# Altium project AVR Board 4.0.PrjPCB
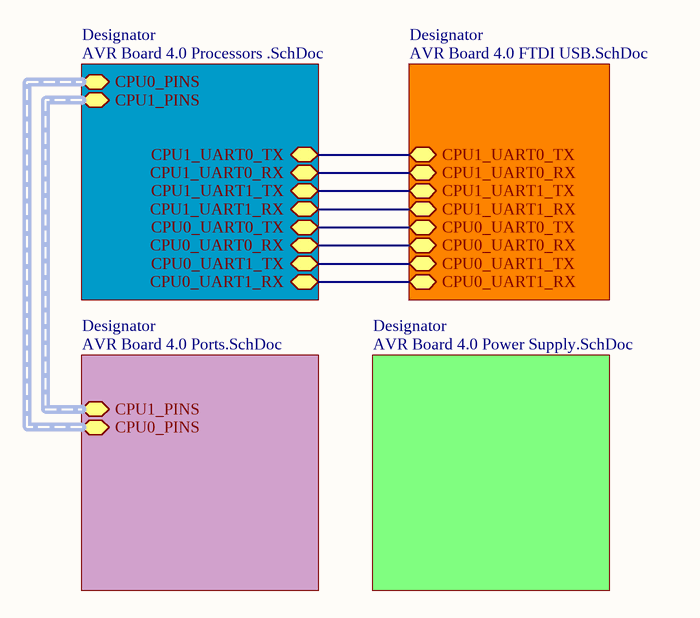
[diagram p0: AVR Board 4.0 Master Sheet.SchDoc]
5 sheets, 133 parts. Net scope: hierarchical (ports join the sheet entries above them; power ports are global).
Board files: AVR Board 4.0 R1.2 Alternate.PcbDoc, AVR Board 4.0 R1.PcbDoc
Sheets:
  AVR Board 4.0 Master Sheet.SchDoc
    Designator = AVR Board 4.0 Processors .SchDoc
    Designator = AVR Board 4.0 FTDI USB.SchDoc
    Designator = AVR Board 4.0 Ports.SchDoc
    Designator = AVR Board 4.0 Power Supply.SchDoc

## Sheet AVR Board 4.0 Master Sheet.SchDoc
size A

### Sub-sheets
Designator = AVR Board 4.0 Processors .SchDoc: CPU1_PINS (harness CPU1_PORTS), CPU0_PINS (harness CPU0_PORTS), CPU1_UART0_TX, CPU1_UART0_RX, CPU1_UART1_TX, CPU1_UART1_RX, CPU0_UART0_TX, CPU0_UART0_RX, CPU0_UART1_TX, CPU0_UART1_RX
Designator = AVR Board 4.0 FTDI USB.SchDoc: CPU1_UART0_TX, CPU1_UART0_RX, CPU1_UART1_TX, CPU1_UART1_RX, CPU0_UART0_TX, CPU0_UART0_RX, CPU0_UART1_TX, CPU0_UART1_RX
Designator = AVR Board 4.0 Ports.SchDoc: CPU1_PINS (harness CPU1_PORTS), CPU0_PINS (harness CPU0_PORTS)
Designator = AVR Board 4.0 Power Supply.SchDoc: no entries

### Nets
NetFTDI_Serial_1: sheet Designator/CPU1_UART0_RX, sheet Designator/CPU1_UART0_RX
NetFTDI_Serial_3: sheet Designator/CPU1_UART0_TX, sheet Designator/CPU1_UART0_TX
NetFTDI_Serial_5: sheet Designator/CPU1_UART1_RX, sheet Designator/CPU1_UART1_RX
NetFTDI_Serial_7: sheet Designator/CPU1_UART1_TX, sheet Designator/CPU1_UART1_TX
NetFTDI_Serial_9: sheet Designator/CPU0_UART0_RX, sheet Designator/CPU0_UART0_RX
NetFTDI_Serial_11: sheet Designator/CPU0_UART0_TX, sheet Designator/CPU0_UART0_TX
NetFTDI_Serial_13: sheet Designator/CPU0_UART1_RX, sheet Designator/CPU0_UART1_RX
NetFTDI_Serial_15: sheet Designator/CPU0_UART1_TX, sheet Designator/CPU0_UART1_TX

## Sheet AVR Board 4.0 Processors .SchDoc
size B
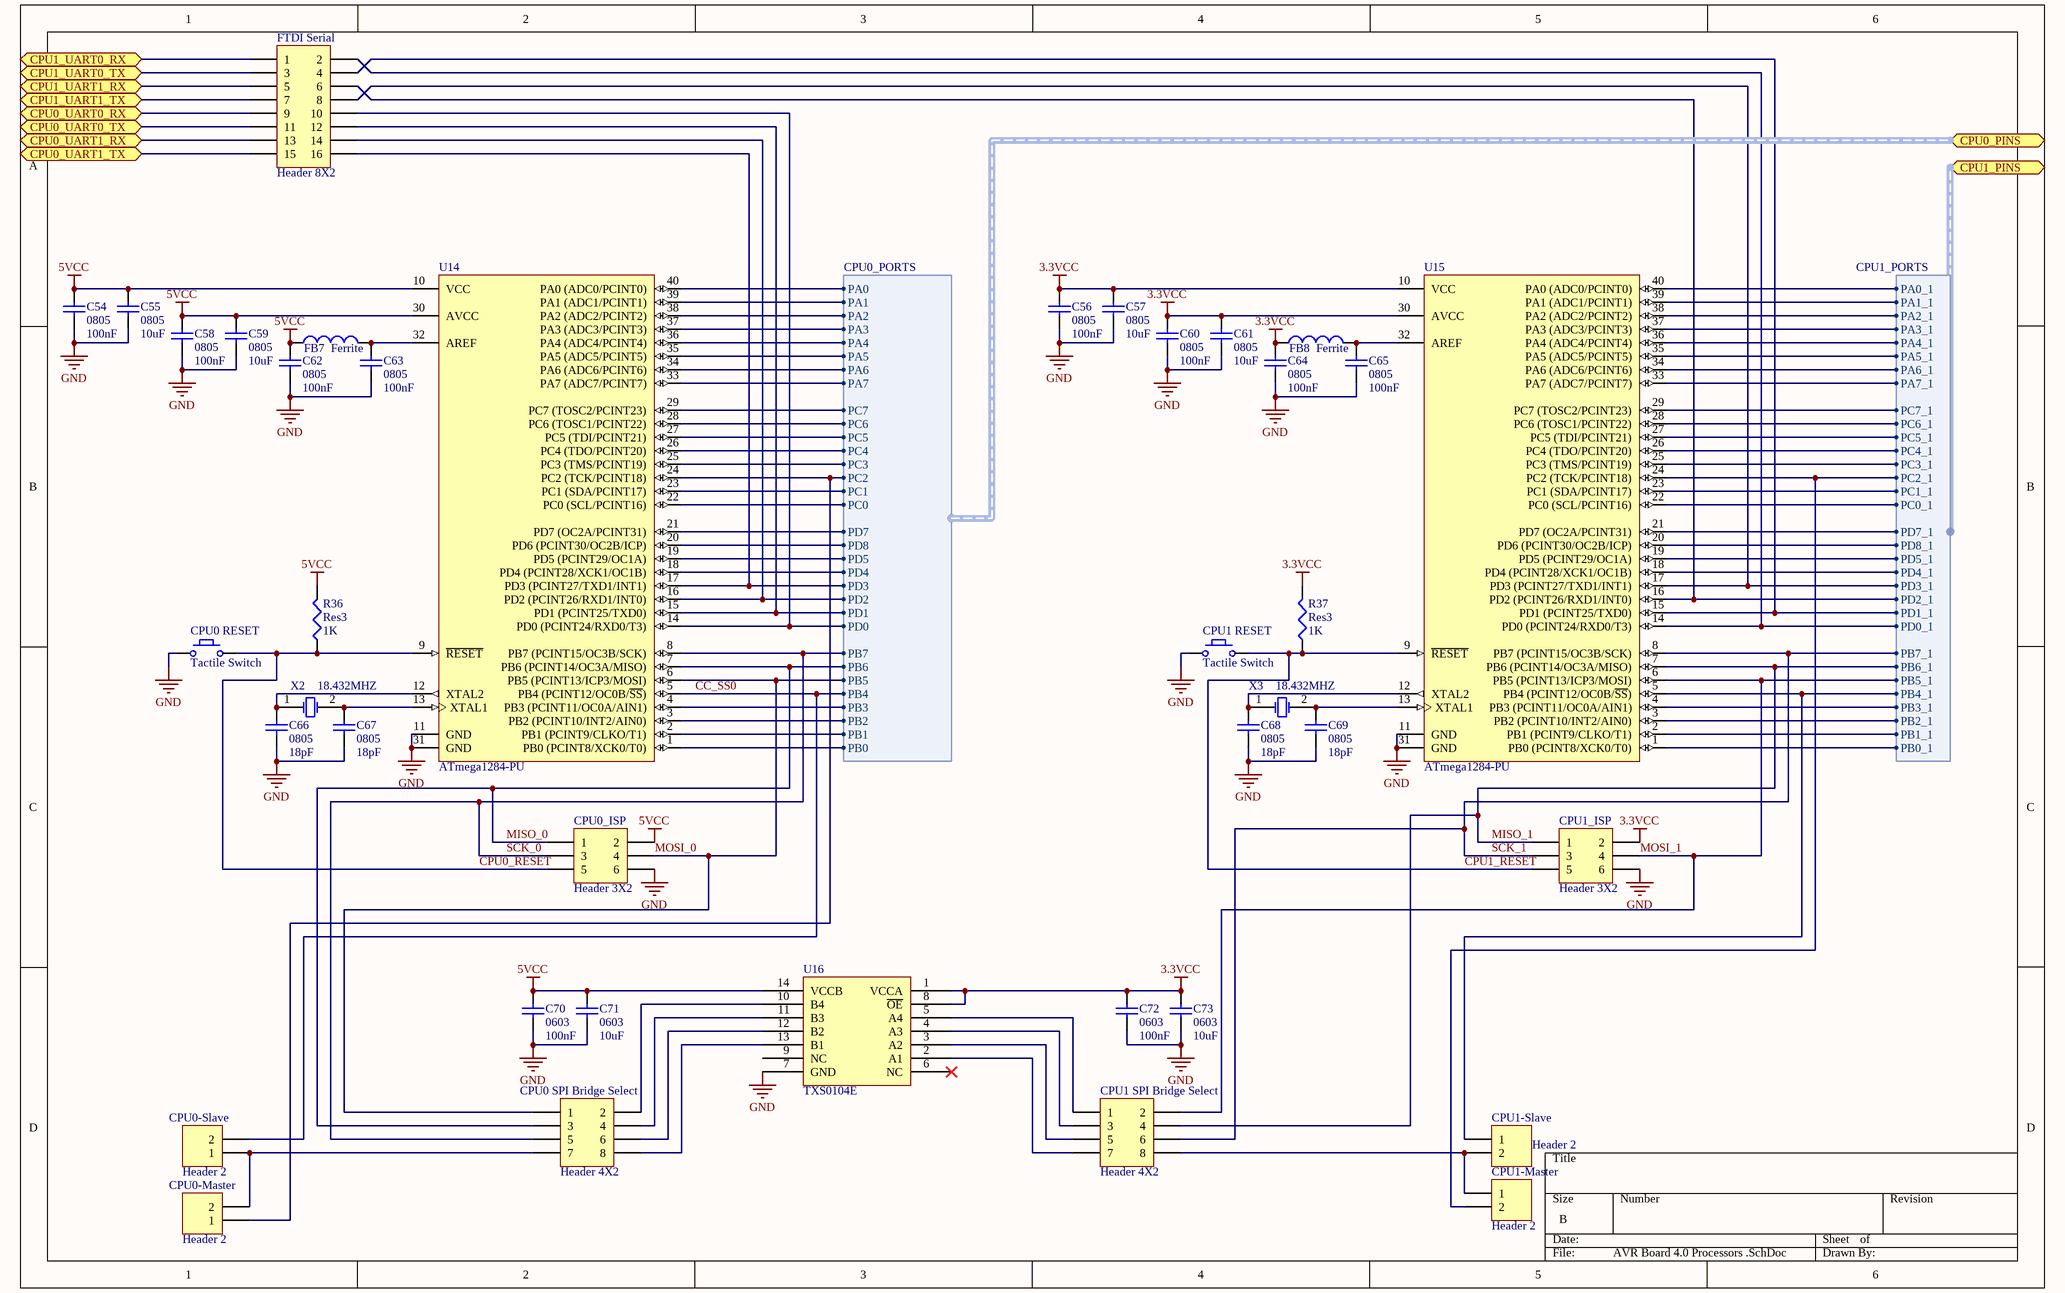
[diagram p1: AVR Board 4.0 Processors .SchDoc]

### Parts
C54  0805  value 100nF  [SM 0805 - gap trimmed]
C55  0805  value 10uF  [SM 0805 - gap trimmed]
C56  0805  value 100nF  [SM 0805 - gap trimmed]
C57  0805  value 10uF  [SM 0805 - gap trimmed]
C58  0805  value 100nF  [SM 0805 - gap trimmed]
C59  0805  value 10uF  [SM 0805 - gap trimmed]
C60  0805  value 100nF  [SM 0805 - gap trimmed]
C61  0805  value 10uF  [SM 0805 - gap trimmed]
C62  0805  value 100nF  [SM 0805 - gap trimmed]
C63  0805  value 100nF  [SM 0805 - gap trimmed]
C64  0805  value 100nF  [SM 0805 - gap trimmed]
C65  0805  value 100nF  [SM 0805 - gap trimmed]
C66  0805  value 18pF  [SM 0805 - gap trimmed]
C67  0805  value 18pF  [SM 0805 - gap trimmed]
C68  0805  value 18pF  [SM 0805 - gap trimmed]
C69  0805  value 18pF  [SM 0805 - gap trimmed]
C70  0603  value 100nF  [1608[0603]]
C71  0603  value 10uF  [1608[0603]]
C72  0603  value 100nF  [1608[0603]]
C73  0603  value 10uF  [1608[0603]]
CPU0-Master  Header 2  [HDR1X2]
CPU0-Slave  Header 2  [HDR1X2]
CPU0_ISP  Header 3X2  [HDR2X3]
CPU0_RESET  Tactile Switch  [Mountain Switch TS6324T1607]
CPU0_SPI_Bridge_Select  Header 4X2  [HDR2X4]
CPU1-Master  Header 2  [HDR1X2]
CPU1-Slave  Header 2  [HDR1X2]
CPU1_ISP  Header 3X2  [HDR2X3]
CPU1_RESET  Tactile Switch  [Mountain Switch TS6324T1607]
CPU1_SPI_Bridge_Select  Header 4X2  [HDR2X4]
FB7  value Ferrite  [SM 0805 - gap trimmed]  (hidden comment: Inductor)
FB8  value Ferrite  [SM 0805 - gap trimmed]  (hidden comment: Inductor)
FTDI_Serial  Header 8X2  [HDR2X8]
R36  Res3  value 1K  [J1-0603]
R37  Res3  value 1K  [J1-0603]
U14  ATmega1284-PU  [40P6]
U15  ATmega1284-PU  [40P6]
U16  TXS0104E  [SOIC127P600X175-14N]
X2  18.432MHZ  [radial 4.88]
X3  18.432MHZ  [radial 4.88]

### Ports
CPU0_PINS (harness CPU0_PORTS), CPU0_UART0_RX, CPU0_UART0_TX, CPU0_UART1_RX, CPU0_UART1_TX, CPU1_PINS (harness CPU1_PORTS), CPU1_UART0_RX, CPU1_UART0_TX, CPU1_UART1_RX, CPU1_UART1_TX

### Harnesses
CPU0_PORTS: PA0, PA1, PA2, PA3, PA4, PA5, PA6, PA7, PC0, PC1, PC2, PC3, PC4, PC5, PC6, PC7, PD7, PD8, PD5, PD4, PD3, PD2, PD1, PD0, PB7, PB6, PB5, PB4, PB3, PB2, PB1, PB0
CPU1_PORTS: PA0_1, PA1_1, PA2_1, PA3_1, PA4_1, PA5_1, PA6_1, PA7_1, PC0_1, PC1_1, PC2_1, PC3_1, PC4_1, PC5_1, PC6_1, PC7_1, PD7_1, PD8_1, PD5_1, PD4_1, PD3_1, PD2_1, PD1_1, PD0_1, PB7_1, PB6_1, PB5_1, PB4_1, PB3_1, PB2_1, PB1_1, PB0_1

### Nets
3.3VCC: C56.2 C57.2 C60.2 C61.2 C64.2 C72.2 C73.2 CPU1_ISP.2 FB8.1 R37.2 U15.10(VCC) U15.30(AVCC) U16.1(VCCA) U16.8(~{OE})
5VCC: C54.2 C55.2 C58.2 C59.2 C62.2 C70.2 C71.2 CPU0_ISP.2 FB7.1 R36.2 U14.10(VCC) U14.30(AVCC) U16.14(VCCB)
GND: C54.1 C55.1 C56.1 C57.1 C58.1 C59.1 C60.1 C61.1 C62.1 C63.1 C64.1 C65.1 C66.1 C67.1 C68.1 C69.1 C70.1 C71.1 C72.1 C73.1 CPU0_ISP.6 CPU0_RESET.1 CPU1_ISP.6 CPU1_RESET.1 U14.11(GND) U14.31(GND) U15.11(GND) U15.31(GND) U16.7(GND)
CC_SS0: CPU0-Slave.2 U14.5(PB4_(PCINT12/OC0B/~{SS})) ; port CPU0_PINS.PB4
CPU0_RESET: CPU0_ISP.5 CPU0_RESET.2 R36.1 U14.9(~{RESET})
CPU1_RESET: CPU1_ISP.5 CPU1_RESET.2 R37.1 U15.9(~{RESET})
MISO_0: CPU0_ISP.1 CPU0_SPI_Bridge_Select.3 U14.7(PB6_(PCINT14/OC3A/MISO)) ; port CPU0_PINS.PB6
MISO_1: CPU1_ISP.1 CPU1_SPI_Bridge_Select.4 U15.7(PB6_(PCINT14/OC3A/MISO)) ; port CPU1_PINS.PB6_1
MOSI_0: CPU0_ISP.4 CPU0_SPI_Bridge_Select.1 U14.6(PB5_(PCINT13/ICP3/MOSI)) ; port CPU0_PINS.PB5
MOSI_1: CPU1_ISP.4 CPU1_SPI_Bridge_Select.2 U15.6(PB5_(PCINT13/ICP3/MOSI)) ; port CPU1_PINS.PB5_1
SCK_0: CPU0_ISP.3 CPU0_SPI_Bridge_Select.5 U14.8(PB7_(PCINT15/OC3B/SCK)) ; port CPU0_PINS.PB7
SCK_1: CPU1_ISP.3 CPU1_SPI_Bridge_Select.6 U15.8(PB7_(PCINT15/OC3B/SCK)) ; port CPU1_PINS.PB7_1
NetC63_2: C63.2 FB7.2 U14.32(AREF)
NetC65_2: C65.2 FB8.2 U15.32(AREF)
NetC66_2: C66.2 U14.12(XTAL2) X2.1(OSC1)
NetC67_2: C67.2 U14.13(XTAL1) X2.2(OSC2)
NetC68_2: C68.2 U15.12(XTAL2) X3.1(OSC1)
NetC69_2: C69.2 U15.13(XTAL1) X3.2(OSC2)
NetCPU0-Master_1: CPU0-Master.1 U14.24(PC2_(TCK/PCINT18)) ; port CPU0_PINS.PC2
NetCPU0-Master_2: CPU0-Master.2 CPU0-Slave.1 CPU0_SPI_Bridge_Select.7
NetCPU0_GPIO_/_ADC_/_SPI_/_TWI_/_UART_1: U14.1(PB0_(PCINT8/XCK0/T0)) ; port CPU0_PINS.PB0
NetCPU0_GPIO_/_ADC_/_SPI_/_TWI_/_UART_2: U14.40(PA0_(ADC0/PCINT0)) ; port CPU0_PINS.PA0
NetCPU0_GPIO_/_ADC_/_SPI_/_TWI_/_UART_3: U14.2(PB1_(PCINT9/CLKO/T1)) ; port CPU0_PINS.PB1
NetCPU0_GPIO_/_ADC_/_SPI_/_TWI_/_UART_4: U14.39(PA1_(ADC1/PCINT1)) ; port CPU0_PINS.PA1
NetCPU0_GPIO_/_ADC_/_SPI_/_TWI_/_UART_5: U14.3(PB2_(PCINT10/INT2/AIN0)) ; port CPU0_PINS.PB2
NetCPU0_GPIO_/_ADC_/_SPI_/_TWI_/_UART_6: U14.38(PA2_(ADC2/PCINT2)) ; port CPU0_PINS.PA2
NetCPU0_GPIO_/_ADC_/_SPI_/_TWI_/_UART_7: U14.4(PB3_(PCINT11/OC0A/AIN1)) ; port CPU0_PINS.PB3
NetCPU0_GPIO_/_ADC_/_SPI_/_TWI_/_UART_8: U14.37(PA3_(ADC3/PCINT3)) ; port CPU0_PINS.PA3
NetCPU0_GPIO_/_ADC_/_SPI_/_TWI_/_UART_10: U14.36(PA4_(ADC4/PCINT4)) ; port CPU0_PINS.PA4
NetCPU0_GPIO_/_ADC_/_SPI_/_TWI_/_UART_12: U14.35(PA5_(ADC5/PCINT5)) ; port CPU0_PINS.PA5
NetCPU0_GPIO_/_ADC_/_SPI_/_TWI_/_UART_14: U14.34(PA6_(ADC6/PCINT6)) ; port CPU0_PINS.PA6
NetCPU0_GPIO_/_ADC_/_SPI_/_TWI_/_UART_16: U14.33(PA7_(ADC7/PCINT7)) ; port CPU0_PINS.PA7
NetCPU0_GPIO_/_ADC_/_SPI_/_TWI_/_UART_17: FTDI_Serial.10 U14.14(PD0_(PCINT24/RXD0/T3)) ; port CPU0_PINS.PD0
NetCPU0_GPIO_/_ADC_/_SPI_/_TWI_/_UART_18: U14.29(PC7_(TOSC2/PCINT23)) ; port CPU0_PINS.PC7
NetCPU0_GPIO_/_ADC_/_SPI_/_TWI_/_UART_19: FTDI_Serial.12 U14.15(PD1_(PCINT25/TXD0)) ; port CPU0_PINS.PD1
NetCPU0_GPIO_/_ADC_/_SPI_/_TWI_/_UART_20: U14.28(PC6_(TOSC1/PCINT22)) ; port CPU0_PINS.PC6
NetCPU0_GPIO_/_ADC_/_SPI_/_TWI_/_UART_21: FTDI_Serial.14 U14.16(PD2_(PCINT26/RXD1/INT0)) ; port CPU0_PINS.PD2
NetCPU0_GPIO_/_ADC_/_SPI_/_TWI_/_UART_22: U14.27(PC5_(TDI/PCINT21)) ; port CPU0_PINS.PC5
NetCPU0_GPIO_/_ADC_/_SPI_/_TWI_/_UART_23: FTDI_Serial.16 U14.17(PD3_(PCINT27/TXD1/INT1)) ; port CPU0_PINS.PD3
NetCPU0_GPIO_/_ADC_/_SPI_/_TWI_/_UART_24: U14.26(PC4_(TDO/PCINT20)) ; port CPU0_PINS.PC4
NetCPU0_GPIO_/_ADC_/_SPI_/_TWI_/_UART_25: U14.18(PD4_(PCINT28/XCK1/OC1B)) ; port CPU0_PINS.PD4
NetCPU0_GPIO_/_ADC_/_SPI_/_TWI_/_UART_26: U14.25(PC3_(TMS/PCINT19)) ; port CPU0_PINS.PC3
NetCPU0_GPIO_/_ADC_/_SPI_/_TWI_/_UART_27: U14.19(PD5_(PCINT29/OC1A)) ; port CPU0_PINS.PD5
NetCPU0_GPIO_/_ADC_/_SPI_/_TWI_/_UART_29: U14.20(PD6_(PCINT30/OC2B/ICP)) ; port CPU0_PINS.PD8
NetCPU0_GPIO_/_ADC_/_SPI_/_TWI_/_UART_30: U14.23(PC1_(SDA/PCINT17)) ; port CPU0_PINS.PC1
NetCPU0_GPIO_/_ADC_/_SPI_/_TWI_/_UART_31: U14.21(PD7_(OC2A/PCINT31)) ; port CPU0_PINS.PD7
NetCPU0_GPIO_/_ADC_/_SPI_/_TWI_/_UART_32: U14.22(PC0_(SCL/PCINT16)) ; port CPU0_PINS.PC0
NetCPU0_SPI_Bridge_Select_2: CPU0_SPI_Bridge_Select.2 U16.10(B4)
NetCPU0_SPI_Bridge_Select_4: CPU0_SPI_Bridge_Select.4 U16.11(B3)
NetCPU0_SPI_Bridge_Select_6: CPU0_SPI_Bridge_Select.6 U16.12(B2)
NetCPU0_SPI_Bridge_Select_8: CPU0_SPI_Bridge_Select.8 U16.13(B1)
NetCPU1-Master_1: CPU1-Master.1 CPU1-Slave.2 CPU1_SPI_Bridge_Select.8
NetCPU1-Master_2: CPU1-Master.2 U15.24(PC2_(TCK/PCINT18)) ; port CPU1_PINS.PC2_1
NetCPU1-Slave_1: CPU1-Slave.1 U15.5(PB4_(PCINT12/OC0B/~{SS})) ; port CPU1_PINS.PB4_1
NetCPU1_GPIO_/_ADC_/_SPI_/_TWI_/_UART_1: U15.1(PB0_(PCINT8/XCK0/T0)) ; port CPU1_PINS.PB0_1
NetCPU1_GPIO_/_ADC_/_SPI_/_TWI_/_UART_2: U15.40(PA0_(ADC0/PCINT0)) ; port CPU1_PINS.PA0_1
NetCPU1_GPIO_/_ADC_/_SPI_/_TWI_/_UART_3: U15.2(PB1_(PCINT9/CLKO/T1)) ; port CPU1_PINS.PB1_1
NetCPU1_GPIO_/_ADC_/_SPI_/_TWI_/_UART_4: U15.39(PA1_(ADC1/PCINT1)) ; port CPU1_PINS.PA1_1
NetCPU1_GPIO_/_ADC_/_SPI_/_TWI_/_UART_5: U15.3(PB2_(PCINT10/INT2/AIN0)) ; port CPU1_PINS.PB2_1
NetCPU1_GPIO_/_ADC_/_SPI_/_TWI_/_UART_6: U15.38(PA2_(ADC2/PCINT2)) ; port CPU1_PINS.PA2_1
NetCPU1_GPIO_/_ADC_/_SPI_/_TWI_/_UART_7: U15.4(PB3_(PCINT11/OC0A/AIN1)) ; port CPU1_PINS.PB3_1
NetCPU1_GPIO_/_ADC_/_SPI_/_TWI_/_UART_8: U15.37(PA3_(ADC3/PCINT3)) ; port CPU1_PINS.PA3_1
NetCPU1_GPIO_/_ADC_/_SPI_/_TWI_/_UART_10: U15.36(PA4_(ADC4/PCINT4)) ; port CPU1_PINS.PA4_1
NetCPU1_GPIO_/_ADC_/_SPI_/_TWI_/_UART_12: U15.35(PA5_(ADC5/PCINT5)) ; port CPU1_PINS.PA5_1
NetCPU1_GPIO_/_ADC_/_SPI_/_TWI_/_UART_14: U15.34(PA6_(ADC6/PCINT6)) ; port CPU1_PINS.PA6_1
NetCPU1_GPIO_/_ADC_/_SPI_/_TWI_/_UART_16: U15.33(PA7_(ADC7/PCINT7)) ; port CPU1_PINS.PA7_1
NetCPU1_GPIO_/_ADC_/_SPI_/_TWI_/_UART_17: FTDI_Serial.2 U15.14(PD0_(PCINT24/RXD0/T3)) ; port CPU1_PINS.PD0_1
NetCPU1_GPIO_/_ADC_/_SPI_/_TWI_/_UART_18: U15.29(PC7_(TOSC2/PCINT23)) ; port CPU1_PINS.PC7_1
NetCPU1_GPIO_/_ADC_/_SPI_/_TWI_/_UART_19: FTDI_Serial.4 U15.15(PD1_(PCINT25/TXD0)) ; port CPU1_PINS.PD1_1
NetCPU1_GPIO_/_ADC_/_SPI_/_TWI_/_UART_20: U15.28(PC6_(TOSC1/PCINT22)) ; port CPU1_PINS.PC6_1
NetCPU1_GPIO_/_ADC_/_SPI_/_TWI_/_UART_21: FTDI_Serial.6 U15.16(PD2_(PCINT26/RXD1/INT0)) ; port CPU1_PINS.PD2_1
NetCPU1_GPIO_/_ADC_/_SPI_/_TWI_/_UART_22: U15.27(PC5_(TDI/PCINT21)) ; port CPU1_PINS.PC5_1
NetCPU1_GPIO_/_ADC_/_SPI_/_TWI_/_UART_23: FTDI_Serial.8 U15.17(PD3_(PCINT27/TXD1/INT1)) ; port CPU1_PINS.PD3_1
NetCPU1_GPIO_/_ADC_/_SPI_/_TWI_/_UART_24: U15.26(PC4_(TDO/PCINT20)) ; port CPU1_PINS.PC4_1
NetCPU1_GPIO_/_ADC_/_SPI_/_TWI_/_UART_25: U15.18(PD4_(PCINT28/XCK1/OC1B)) ; port CPU1_PINS.PD4_1
NetCPU1_GPIO_/_ADC_/_SPI_/_TWI_/_UART_26: U15.25(PC3_(TMS/PCINT19)) ; port CPU1_PINS.PC3_1
NetCPU1_GPIO_/_ADC_/_SPI_/_TWI_/_UART_27: U15.19(PD5_(PCINT29/OC1A)) ; port CPU1_PINS.PD5_1
NetCPU1_GPIO_/_ADC_/_SPI_/_TWI_/_UART_29: U15.20(PD6_(PCINT30/OC2B/ICP)) ; port CPU1_PINS.PD8_1
NetCPU1_GPIO_/_ADC_/_SPI_/_TWI_/_UART_30: U15.23(PC1_(SDA/PCINT17)) ; port CPU1_PINS.PC1_1
NetCPU1_GPIO_/_ADC_/_SPI_/_TWI_/_UART_31: U15.21(PD7_(OC2A/PCINT31)) ; port CPU1_PINS.PD7_1
NetCPU1_GPIO_/_ADC_/_SPI_/_TWI_/_UART_32: U15.22(PC0_(SCL/PCINT16)) ; port CPU1_PINS.PC0_1
NetCPU1_SPI_Bridge_Select_1: CPU1_SPI_Bridge_Select.1 U16.5(A4)
NetCPU1_SPI_Bridge_Select_3: CPU1_SPI_Bridge_Select.3 U16.4(A3)
NetCPU1_SPI_Bridge_Select_5: CPU1_SPI_Bridge_Select.5 U16.3(A2)
NetCPU1_SPI_Bridge_Select_7: CPU1_SPI_Bridge_Select.7 U16.2(A1)
NetFTDI_Serial_1: FTDI_Serial.1 ; port CPU1_UART0_RX
NetFTDI_Serial_3: FTDI_Serial.3 ; port CPU1_UART0_TX
NetFTDI_Serial_5: FTDI_Serial.5 ; port CPU1_UART1_RX
NetFTDI_Serial_7: FTDI_Serial.7 ; port CPU1_UART1_TX
NetFTDI_Serial_9: FTDI_Serial.9 ; port CPU0_UART0_RX
NetFTDI_Serial_11: FTDI_Serial.11 ; port CPU0_UART0_TX
NetFTDI_Serial_13: FTDI_Serial.13 ; port CPU0_UART1_RX
NetFTDI_Serial_15: FTDI_Serial.15 ; port CPU0_UART1_TX

Not connected (* = marked no-connect by the designer): U16 6(NC)* 9(NC)

### Library data of the parts
C54-C73 = Cap Semi: Capacitor (Semiconductor SIM Model); Published: 8-Jun-2000; LatestRevisionDate: 29-May-2009; LatestRevisionNote: IPC-7351 Footprint Added.; PackageReference: C1206; Publisher: Altium Limited; PackageDescription: Chip Capacitor
CPU0-Master CPU0-Slave CPU1-Master CPU1-Slave = Header 2: Header, 2-Pin; LatestRevisionDate: 17-Jul-2002; LatestRevisionNote: Re-released for DXP Platform.; Publisher: Altium Limited
CPU0_ISP CPU1_ISP = Header 3X2: Header, 3-Pin, Dual row; LatestRevisionDate: 17-Jul-2002; LatestRevisionNote: Re-released for DXP Platform.; Publisher: Altium Limited
CPU0_SPI_Bridge_Select CPU1_SPI_Bridge_Select = Header 4X2: Header, 4-Pin, Dual row; LatestRevisionDate: 17-Jul-2002; LatestRevisionNote: Re-released for DXP Platform.; Publisher: Altium Limited
FB7 FB8 = Inductor: Code_IEC: 1005; Published: 8-Jun-2000; LatestRevisionDate: 29-May-2009; LatestRevisionNote: IPC-7351 Footprint Added.; PackageReference: 0402-A; Publisher: Altium Limited; PackageDescription: Chip Inductor; Code_JEITA: 0402
FTDI_Serial = Header 8X2: Header, 8-Pin, Dual row; LatestRevisionDate: 17-Jul-2002; LatestRevisionNote: Re-released for DXP Platform.; Publisher: Altium Limited
R36 R37 = Res3: Resistor; Published: 8-Jun-2000; LatestRevisionDate: 29-May-2009; LatestRevisionNote: IPC-7351 Footprint Added.; PackageReference: J1-0603; Publisher: Altium Limited; PackageDescription: Chip Resistor
U14 U15 = ATmega1284-PU: 8-bit AVR Microcontroller, 128KB Flash, 4KB EEPROM, 16KB SRAM, 40-pin PDIP, Industrial Grade (-40°C to 85°C); DatasheetVersion: revC, Jun-2011; PackageVersion: revB, Sep-2001; PackageReference: 40P6; PackageDescription: 40-lead (0.600"/15.24mm Wide) Plastic Dual Inline Package (PDIP); Code_JEDEC: MS-011-AC; ComponentLink1Description: Manufacturer URL; ComponentLink1URL: http://www.atmel.com/; ComponentLink2Description: ATmega164A/164PA/324A/324PA/644A/644PA/1284/1284P Datasheet; ComponentLink2URL: http://www.atmel.com/dyn/resources/prod_documents/doc8272.pdf; ComponentLink3Description: ATmega164A/164PA/324A/324PA/644A/644PA/1284/1284P Summary; ComponentLink3URL: http://www.atmel.com/dyn/resources/prod_documents/8272S.pdf
X2 X3 = XTAL: Crystal Oscillator; Published: 8-Jun-2000; LatestRevisionDate: 17-Jul-2002; LatestRevisionNote: Re-released for DXP Platform.; PackageReference: R38; Publisher: Altium Limited; PackageDescription: Crystal, Thru-Hole; 2 Leads; Body 3.1 x 8.2 mm (Dia.xH)

## Sheet AVR Board 4.0 FTDI USB.SchDoc
size B
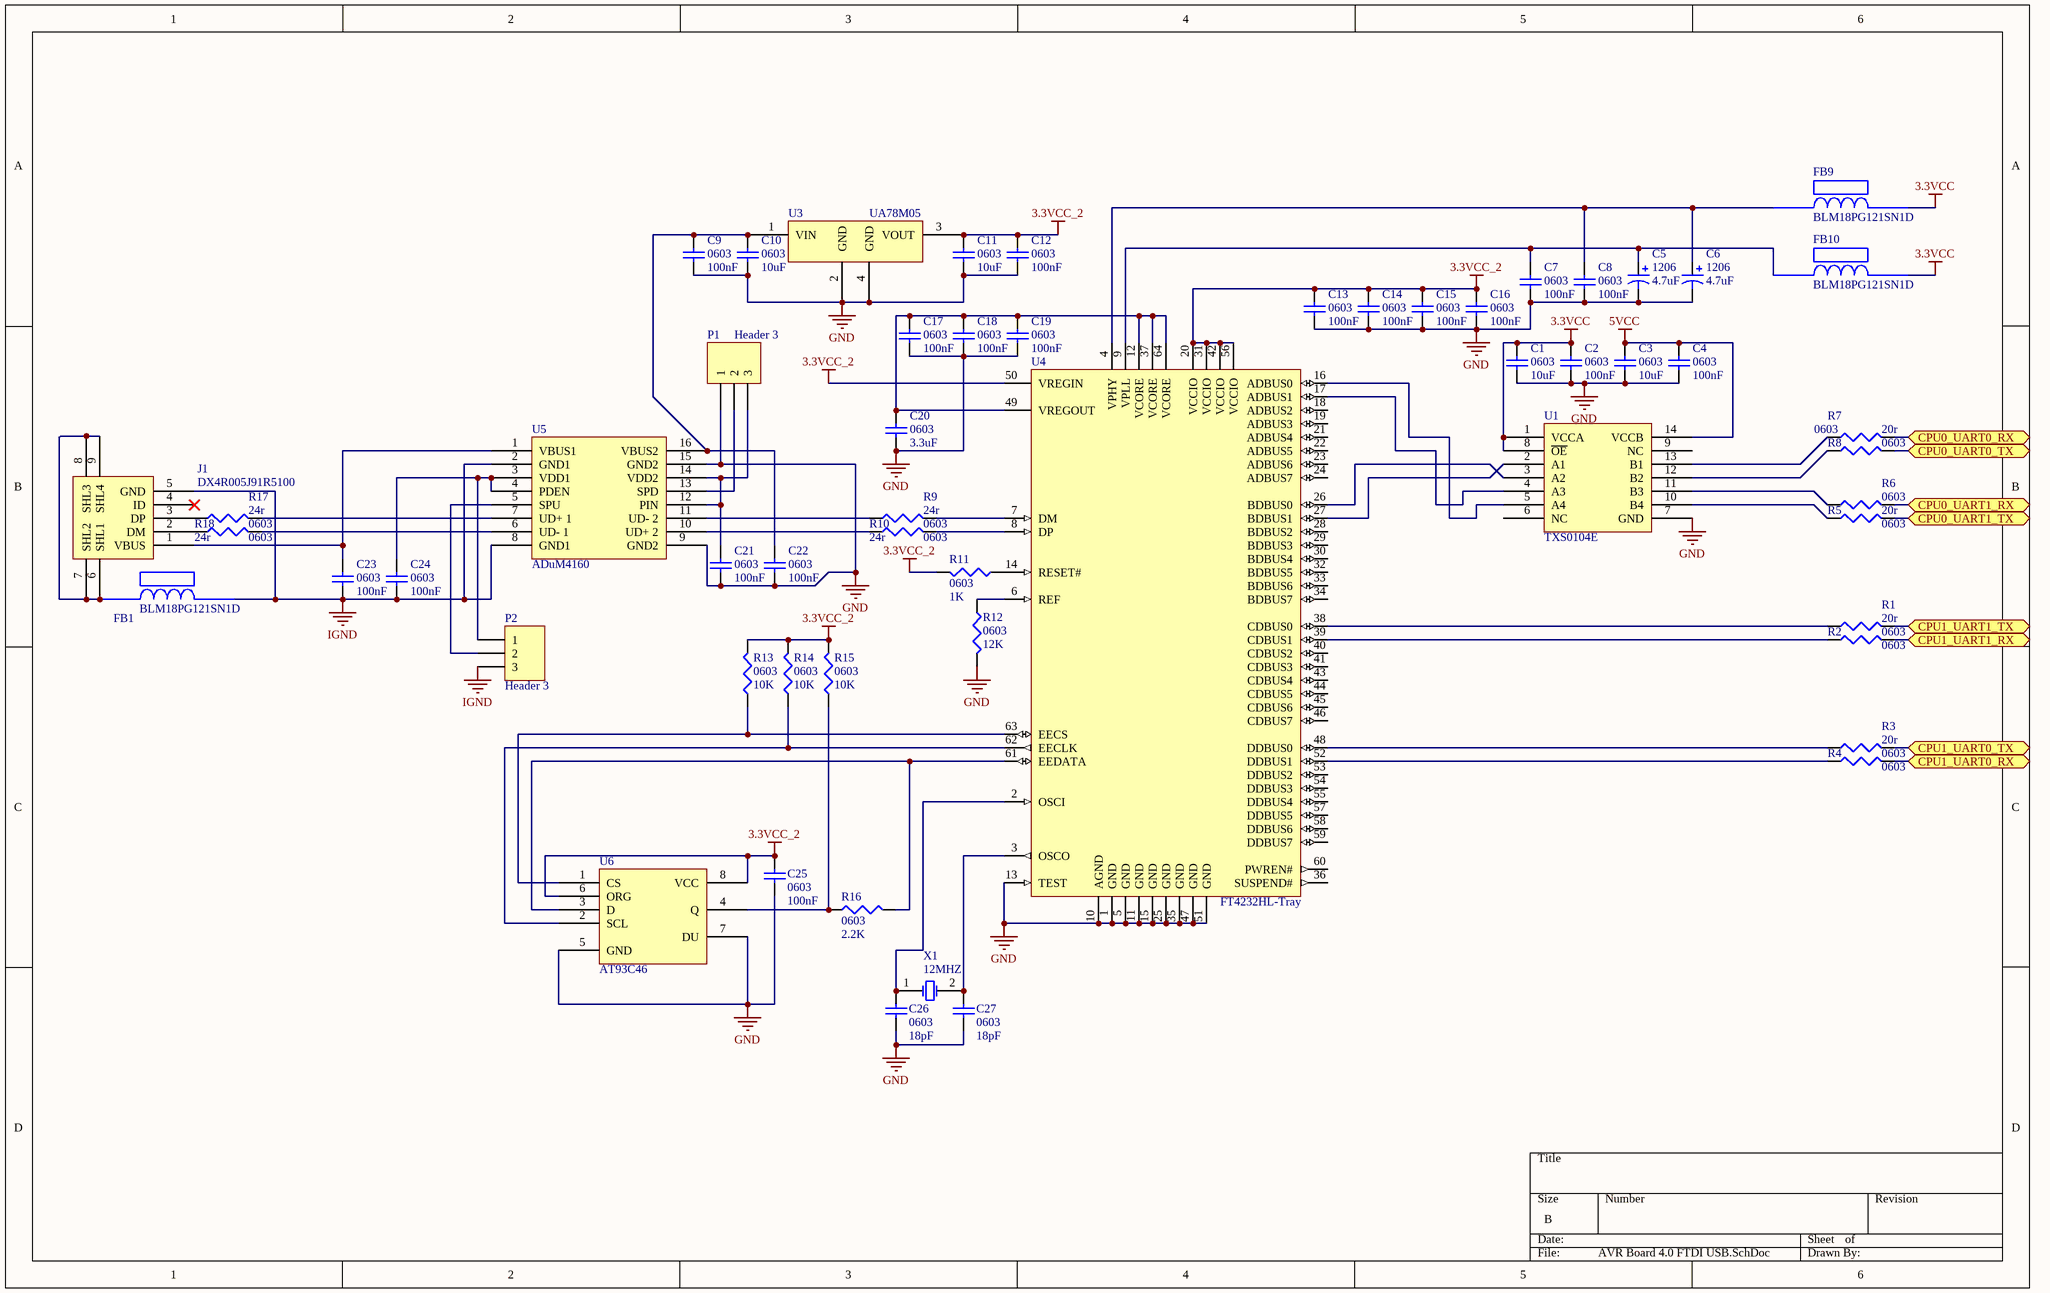
[diagram p2: AVR Board 4.0 FTDI USB.SchDoc]

### Parts
C1  0603  value 10uF  [1608[0603]]
C2  0603  value 100nF  [1608[0603]]
C3  0603  value 10uF  [1608[0603]]
C4  0603  value 100nF  [1608[0603]]
C5  1206  value 4.7uF  [C1206POL]
C6  1206  value 4.7uF  [C1206POL]
C7  0603  value 100nF  [1608[0603]]
C8  0603  value 100nF  [1608[0603]]
C9  0603  value 100nF  [1608[0603]]
C10  0603  value 10uF  [1608[0603]]
C11  0603  value 10uF  [1608[0603]]
C12  0603  value 100nF  [1608[0603]]
C13  0603  value 100nF  [1608[0603]]
C14  0603  value 100nF  [1608[0603]]
C15  0603  value 100nF  [1608[0603]]
C16  0603  value 100nF  [1608[0603]]
C17  0603  value 100nF  [1608[0603]]
C18  0603  value 100nF  [1608[0603]]
C19  0603  value 100nF  [1608[0603]]
C20  0603  value 3.3uF  [1608[0603]]
C21  0603  value 100nF  [1608[0603]]
C22  0603  value 100nF  [1608[0603]]
C23  0603  value 100nF  [1608[0603]]
C24  0603  value 100nF  [1608[0603]]
C25  0603  value 100nF  [1608[0603]]
C26  0603  value 18pF  [1608[0603]]
C27  0603  value 18pF  [1608[0603]]
FB1  BLM18PG121SN1D  [BLM18PG121SN1D]
FB9  BLM18PG121SN1D  [BLM18PG121SN1D]
FB10  BLM18PG121SN1D  [BLM18PG121SN1D]
J1  DX4R005J91R5100  [Micro USB Circular Holes Only]
P1  Header 3  [HDR1X3]
P2  Header 3  [HDR1X3]
R1  0603  value 20r  [J1-0603]
R2  0603  [J1-0603]
R3  0603  value 20r  [J1-0603]
R4  0603  [J1-0603]
R5  0603  value 20r  [J1-0603]
R6  0603  [J1-0603]
R7  0603  value 20r  [J1-0603]
R8  0603  [J1-0603]
R9  0603  value 24r  [J1-0603]
R10  0603  value 24r  [J1-0603]
R11  0603  value 1K  [J1-0603]
R12  0603  value 12K  [J1-0603]
R13  0603  value 10K  [J1-0603]
R14  0603  value 10K  [J1-0603]
R15  0603  value 10K  [J1-0603]
R16  0603  value 2.2K  [J1-0603]
R17  0603  value 24r  [J1-0603]
R18  0603  value 24r  [J1-0603]
U1  TXS0104E  [SOIC127P600X175-14N]
U3  UA78M05  [SOT230P700X180-4N]
U4  FT4232HL-Tray  [LQFP-64_N]
U5  ADuM4160  [ADuM4160]
U6  AT93C46  [SOIC127P600X175-8N]
X1  12MHZ  [445C35A12M00000]

### Ports
CPU0_UART0_RX, CPU0_UART0_TX, CPU0_UART1_RX, CPU0_UART1_TX, CPU1_UART0_RX, CPU1_UART0_TX, CPU1_UART1_RX, CPU1_UART1_TX

### Nets
3.3VCC: C1.2 C2.2 FB9.2 FB10.2 U1.1(VCCA) U1.8(~{OE})
3.3VCC_2: C11.2 C12.2 C13.2 C14.2 C15.2 C16.2 C25.2 R11.2 R13.2 R14.2 R15.2 U3.3(VOUT) U4.20(VCCIO) U4.31(VCCIO) U4.42(VCCIO) U4.50(VREGIN) U4.56(VCCIO) U6.6(ORG) U6.8(VCC)
5VCC: C3.2 C4.2 U1.14(VCCB)
GND: C1.1 C2.1 C3.1 C4.1 C5.2 C6.2 C7.1 C8.1 C9.1 C10.1 C11.1 C12.1 C13.1 C14.1 C15.1 C16.1 C17.1 C18.1 C19.1 C20.1 C21.1 C22.1 C25.1 C26.1 C27.1 P1.1 R12.2 U1.7(GND) U3.2(GND) U3.4(GND) U4.1(GND) U4.5(GND) U4.10(AGND) U4.11(GND) U4.13(TEST) U4.15(GND) U4.25(GND) U4.35(GND) U4.47(GND) U4.51(GND) U5.9(GND2) U5.15(GND2) U6.5(GND) U6.7(DU)
IGND: C23.1 C24.1 FB1.2 J1.5(GND) P2.3 U5.2(GND1) U5.8(GND1)
NetC5_1: C5.1 C7.2 FB10.1 U4.9(VPLL)
NetC6_1: C6.1 C8.2 FB9.1 U4.4(VPHY)
NetC9_2: C9.2 C10.2 C22.2 U3.1(VIN) U5.16(VBUS2)
NetC17_2: C17.2 C18.2 C19.2 C20.2 U4.12(VCORE) U4.37(VCORE) U4.49(VREGOUT) U4.64(VCORE)
NetC21_2: C21.2 P1.3 U5.12(PIN) U5.14(VDD2)
NetC23_2: C23.2 J1.1(VBUS) U5.1(VBUS1)
NetC24_2: C24.2 P2.1 U5.3(VDD1) U5.4(PDEN)
NetC26_2: C26.2 U4.2(OSCI) X1.1(OSC1)
NetC27_2: C27.2 U4.3(OSCO) X1.2(OSC2)
NetFB1_1: FB1.1 J1.6(SHL1) J1.7(SHL2) J1.8(SHL3) J1.9(SHL4)
NetFTDI_Serial_1: R4.2 ; port CPU1_UART0_RX
NetFTDI_Serial_3: R3.2 ; port CPU1_UART0_TX
NetFTDI_Serial_5: R2.2 ; port CPU1_UART1_RX
NetFTDI_Serial_7: R1.2 ; port CPU1_UART1_TX
NetFTDI_Serial_9: R7.2 ; port CPU0_UART0_RX
NetFTDI_Serial_11: R8.2 ; port CPU0_UART0_TX
NetFTDI_Serial_13: R6.2 ; port CPU0_UART1_RX
NetFTDI_Serial_15: R5.2 ; port CPU0_UART1_TX
NetJ1_2: J1.2(DM) R18.1
NetJ1_3: J1.3(DP) R17.1
NetP1_2: P1.2 U5.13(SPD)
NetP2_2: P2.2 U5.5(SPU)
NetR1_1: R1.1 U4.38(CDBUS0)
NetR2_1: R2.1 U4.39(CDBUS1)
NetR3_1: R3.1 U4.48(DDBUS0)
NetR4_1: R4.1 U4.52(DDBUS1)
NetR5_1: R5.1 U1.10(B4)
NetR6_1: R6.1 U1.11(B3)
NetR7_1: R7.1 U1.13(B1)
NetR8_1: R8.1 U1.12(B2)
NetR9_1: R9.1 U5.11(UD-_2)
NetR9_2: R9.2 U4.7(DM)
NetR10_1: R10.1 U5.10(UD+_2)
NetR10_2: R10.2 U4.8(DP)
NetR11_1: R11.1 U4.14(RESET#)
NetR12_1: R12.1 U4.6(REF)
NetR13_1: R13.1 U4.63(EECS) U6.1(CS)
NetR14_1: R14.1 U4.62(EECLK) U6.2(SCL)
NetR15_1: R15.1 R16.1 U6.4(Q)
NetR16_2: R16.2 U4.61(EEDATA) U6.3(D)
NetR17_2: R17.2 U5.7(UD+_1)
NetR18_2: R18.2 U5.6(UD-_1)
NetU1_2: U1.2(A1) U4.27(BDBUS1)
NetU1_3: U1.3(A2) U4.26(BDBUS0)
NetU1_4: U1.4(A3) U4.17(ADBUS1)
NetU1_5: U1.5(A4) U4.16(ADBUS0)

Not connected (* = marked no-connect by the designer): J1 4(ID)*; U1 6(NC) 9(NC); U4 18(ADBUS2) 19(ADBUS3) 21(ADBUS4) 22(ADBUS5) 23(ADBUS6) 24(ADBUS7) 28(BDBUS2) 29(BDBUS3) 30(BDBUS4) 32(BDBUS5) 33(BDBUS6) 34(BDBUS7) 36(SUSPEND#) 40(CDBUS2) 41(CDBUS3) 43(CDBUS4) 44(CDBUS5) 45(CDBUS6) 46(CDBUS7) 53(DDBUS2) 54(DDBUS3) 55(DDBUS4) 57(DDBUS5) 58(DDBUS6) 59(DDBUS7) 60(PWREN#)

### Library data of the parts
C1-C4 C7-C27 = Cap Semi: Capacitor (Semiconductor SIM Model); Published: 8-Jun-2000; LatestRevisionDate: 29-May-2009; LatestRevisionNote: IPC-7351 Footprint Added.; PackageReference: C1206; Publisher: Altium Limited; PackageDescription: Chip Capacitor
C5 C6 = Cap Pol3: Polarized Capacitor (Surface Mount); Published: 8-Jun-2000; LatestRevisionDate: 29-May-2009; LatestRevisionNote: IPC-7351 Footprint Added.; PackageReference: C0805; Publisher: Altium Limited; PackageDescription: Chip Capacitor
J1 = Micro USB: Micro USB Jack B
P1 P2 = Header 3: Header, 3-Pin; LatestRevisionDate: 17-Jul-2002; LatestRevisionNote: Re-released for DXP Platform.; Publisher: Altium Limited
R1-R18 = Res3: Resistor; Published: 8-Jun-2000; LatestRevisionDate: 29-May-2009; LatestRevisionNote: IPC-7351 Footprint Added.; PackageReference: J1-0603; Publisher: Altium Limited; PackageDescription: Chip Resistor
U4 = FT4232HL-Tray: Quad High Speed USB To Multipurpose UART/MPSSE IC, 64-pin LQFP, Tray; Manufacturer: FTDI; DatasheetVersion: ver 2.2, Jan-2012; PackageVersion: Jan-12; PackageReference: LQFP-64; PackageDescription: 64-Pin Thin Quad Flat Pack, 10 x 10 x 1.4 mm Body, 0.5 mm Pitch; PartNumber: FT4232HL-Tray; ComponentLink1Description: Manufacturer URL; ComponentLink1URL: http://www.ftdichip.com/; ComponentLink2Description: Datasheet; ComponentLink2URL: http://www.ftdichip.com/Support/Documents/DataSheets/ICs/DS_FT4232H.pdf
U5 = ADuM4160: USB Opto Isolator
X1 = XTAL: Crystal Oscillator; Published: 8-Jun-2000; LatestRevisionDate: 17-Jul-2002; LatestRevisionNote: Re-released for DXP Platform.; PackageReference: R38; Publisher: Altium Limited; PackageDescription: Crystal, Thru-Hole; 2 Leads; Body 3.1 x 8.2 mm (Dia.xH)

## Sheet AVR Board 4.0 Ports.SchDoc
size A
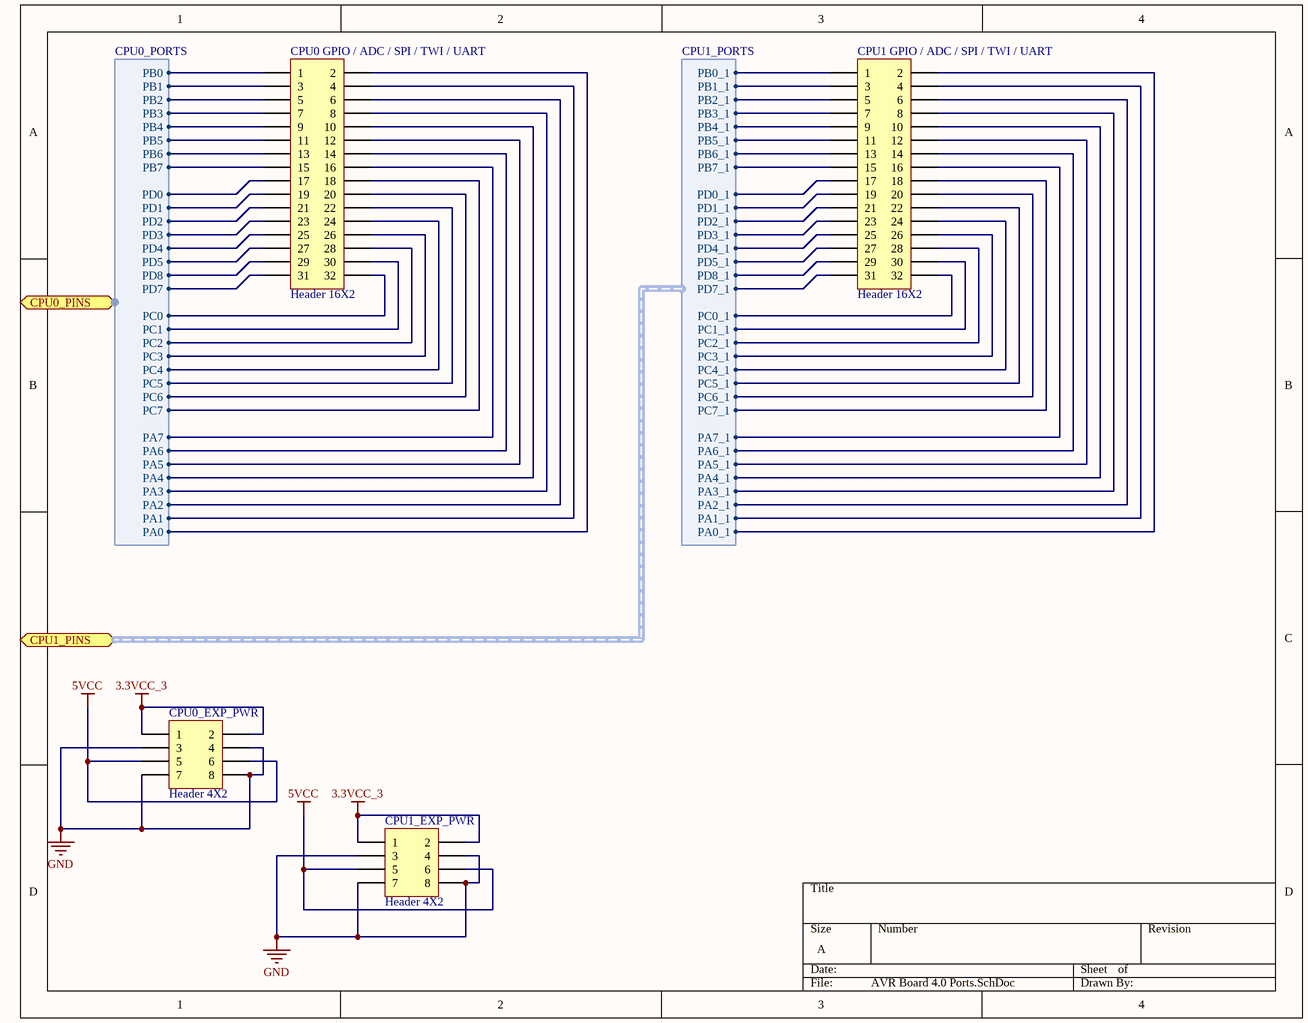
[diagram p3: AVR Board 4.0 Ports.SchDoc]

### Parts
CPU0_EXP_PWR  Header 4X2  [HDR2X4]
CPU0_GPIO_/_ADC_/_SPI_/_TWI_/_UART  Header 16X2  [HDR2X16]
CPU1_EXP_PWR  Header 4X2  [HDR2X4]
CPU1_GPIO_/_ADC_/_SPI_/_TWI_/_UART  Header 16X2  [HDR2X16]

### Ports
CPU0_PINS (harness CPU0_PORTS), CPU1_PINS (harness CPU1_PORTS)

### Harnesses
CPU0_PORTS: PA0, PA1, PA2, PA3, PA4, PA5, PA6, PA7, PC0, PC1, PC2, PC3, PC4, PC5, PC6, PC7, PD7, PD8, PD5, PD4, PD3, PD2, PD1, PD0, PB7, PB6, PB5, PB4, PB3, PB2, PB1, PB0
CPU1_PORTS: PA0_1, PA1_1, PA2_1, PA3_1, PA4_1, PA5_1, PA6_1, PA7_1, PC0_1, PC1_1, PC2_1, PC3_1, PC4_1, PC5_1, PC6_1, PC7_1, PD7_1, PD8_1, PD5_1, PD4_1, PD3_1, PD2_1, PD1_1, PD0_1, PB7_1, PB6_1, PB5_1, PB4_1, PB3_1, PB2_1, PB1_1, PB0_1

### Nets
3.3VCC_3: CPU0_EXP_PWR.1 CPU0_EXP_PWR.2 CPU1_EXP_PWR.1 CPU1_EXP_PWR.2
5VCC: CPU0_EXP_PWR.5 CPU0_EXP_PWR.6 CPU1_EXP_PWR.5 CPU1_EXP_PWR.6
GND: CPU0_EXP_PWR.3 CPU0_EXP_PWR.4 CPU0_EXP_PWR.7 CPU0_EXP_PWR.8 CPU1_EXP_PWR.3 CPU1_EXP_PWR.4 CPU1_EXP_PWR.7 CPU1_EXP_PWR.8
CC_SS0: CPU0_GPIO_/_ADC_/_SPI_/_TWI_/_UART.9 ; port CPU0_PINS.PB4
MISO_0: CPU0_GPIO_/_ADC_/_SPI_/_TWI_/_UART.13 ; port CPU0_PINS.PB6
MISO_1: CPU1_GPIO_/_ADC_/_SPI_/_TWI_/_UART.13 ; port CPU1_PINS.PB6_1
MOSI_0: CPU0_GPIO_/_ADC_/_SPI_/_TWI_/_UART.11 ; port CPU0_PINS.PB5
MOSI_1: CPU1_GPIO_/_ADC_/_SPI_/_TWI_/_UART.11 ; port CPU1_PINS.PB5_1
SCK_0: CPU0_GPIO_/_ADC_/_SPI_/_TWI_/_UART.15 ; port CPU0_PINS.PB7
SCK_1: CPU1_GPIO_/_ADC_/_SPI_/_TWI_/_UART.15 ; port CPU1_PINS.PB7_1
NetCPU0-Master_1: CPU0_GPIO_/_ADC_/_SPI_/_TWI_/_UART.28 ; port CPU0_PINS.PC2
NetCPU0_GPIO_/_ADC_/_SPI_/_TWI_/_UART_1: CPU0_GPIO_/_ADC_/_SPI_/_TWI_/_UART.1 ; port CPU0_PINS.PB0
NetCPU0_GPIO_/_ADC_/_SPI_/_TWI_/_UART_2: CPU0_GPIO_/_ADC_/_SPI_/_TWI_/_UART.2 ; port CPU0_PINS.PA0
NetCPU0_GPIO_/_ADC_/_SPI_/_TWI_/_UART_3: CPU0_GPIO_/_ADC_/_SPI_/_TWI_/_UART.3 ; port CPU0_PINS.PB1
NetCPU0_GPIO_/_ADC_/_SPI_/_TWI_/_UART_4: CPU0_GPIO_/_ADC_/_SPI_/_TWI_/_UART.4 ; port CPU0_PINS.PA1
NetCPU0_GPIO_/_ADC_/_SPI_/_TWI_/_UART_5: CPU0_GPIO_/_ADC_/_SPI_/_TWI_/_UART.5 ; port CPU0_PINS.PB2
NetCPU0_GPIO_/_ADC_/_SPI_/_TWI_/_UART_6: CPU0_GPIO_/_ADC_/_SPI_/_TWI_/_UART.6 ; port CPU0_PINS.PA2
NetCPU0_GPIO_/_ADC_/_SPI_/_TWI_/_UART_7: CPU0_GPIO_/_ADC_/_SPI_/_TWI_/_UART.7 ; port CPU0_PINS.PB3
NetCPU0_GPIO_/_ADC_/_SPI_/_TWI_/_UART_8: CPU0_GPIO_/_ADC_/_SPI_/_TWI_/_UART.8 ; port CPU0_PINS.PA3
NetCPU0_GPIO_/_ADC_/_SPI_/_TWI_/_UART_10: CPU0_GPIO_/_ADC_/_SPI_/_TWI_/_UART.10 ; port CPU0_PINS.PA4
NetCPU0_GPIO_/_ADC_/_SPI_/_TWI_/_UART_12: CPU0_GPIO_/_ADC_/_SPI_/_TWI_/_UART.12 ; port CPU0_PINS.PA5
NetCPU0_GPIO_/_ADC_/_SPI_/_TWI_/_UART_14: CPU0_GPIO_/_ADC_/_SPI_/_TWI_/_UART.14 ; port CPU0_PINS.PA6
NetCPU0_GPIO_/_ADC_/_SPI_/_TWI_/_UART_16: CPU0_GPIO_/_ADC_/_SPI_/_TWI_/_UART.16 ; port CPU0_PINS.PA7
NetCPU0_GPIO_/_ADC_/_SPI_/_TWI_/_UART_17: CPU0_GPIO_/_ADC_/_SPI_/_TWI_/_UART.17 ; port CPU0_PINS.PD0
NetCPU0_GPIO_/_ADC_/_SPI_/_TWI_/_UART_18: CPU0_GPIO_/_ADC_/_SPI_/_TWI_/_UART.18 ; port CPU0_PINS.PC7
NetCPU0_GPIO_/_ADC_/_SPI_/_TWI_/_UART_19: CPU0_GPIO_/_ADC_/_SPI_/_TWI_/_UART.19 ; port CPU0_PINS.PD1
NetCPU0_GPIO_/_ADC_/_SPI_/_TWI_/_UART_20: CPU0_GPIO_/_ADC_/_SPI_/_TWI_/_UART.20 ; port CPU0_PINS.PC6
NetCPU0_GPIO_/_ADC_/_SPI_/_TWI_/_UART_21: CPU0_GPIO_/_ADC_/_SPI_/_TWI_/_UART.21 ; port CPU0_PINS.PD2
NetCPU0_GPIO_/_ADC_/_SPI_/_TWI_/_UART_22: CPU0_GPIO_/_ADC_/_SPI_/_TWI_/_UART.22 ; port CPU0_PINS.PC5
NetCPU0_GPIO_/_ADC_/_SPI_/_TWI_/_UART_23: CPU0_GPIO_/_ADC_/_SPI_/_TWI_/_UART.23 ; port CPU0_PINS.PD3
NetCPU0_GPIO_/_ADC_/_SPI_/_TWI_/_UART_24: CPU0_GPIO_/_ADC_/_SPI_/_TWI_/_UART.24 ; port CPU0_PINS.PC4
NetCPU0_GPIO_/_ADC_/_SPI_/_TWI_/_UART_25: CPU0_GPIO_/_ADC_/_SPI_/_TWI_/_UART.25 ; port CPU0_PINS.PD4
NetCPU0_GPIO_/_ADC_/_SPI_/_TWI_/_UART_26: CPU0_GPIO_/_ADC_/_SPI_/_TWI_/_UART.26 ; port CPU0_PINS.PC3
NetCPU0_GPIO_/_ADC_/_SPI_/_TWI_/_UART_27: CPU0_GPIO_/_ADC_/_SPI_/_TWI_/_UART.27 ; port CPU0_PINS.PD5
NetCPU0_GPIO_/_ADC_/_SPI_/_TWI_/_UART_29: CPU0_GPIO_/_ADC_/_SPI_/_TWI_/_UART.29 ; port CPU0_PINS.PD8
NetCPU0_GPIO_/_ADC_/_SPI_/_TWI_/_UART_30: CPU0_GPIO_/_ADC_/_SPI_/_TWI_/_UART.30 ; port CPU0_PINS.PC1
NetCPU0_GPIO_/_ADC_/_SPI_/_TWI_/_UART_31: CPU0_GPIO_/_ADC_/_SPI_/_TWI_/_UART.31 ; port CPU0_PINS.PD7
NetCPU0_GPIO_/_ADC_/_SPI_/_TWI_/_UART_32: CPU0_GPIO_/_ADC_/_SPI_/_TWI_/_UART.32 ; port CPU0_PINS.PC0
NetCPU1-Master_2: CPU1_GPIO_/_ADC_/_SPI_/_TWI_/_UART.28 ; port CPU1_PINS.PC2_1
NetCPU1-Slave_1: CPU1_GPIO_/_ADC_/_SPI_/_TWI_/_UART.9 ; port CPU1_PINS.PB4_1
NetCPU1_GPIO_/_ADC_/_SPI_/_TWI_/_UART_1: CPU1_GPIO_/_ADC_/_SPI_/_TWI_/_UART.1 ; port CPU1_PINS.PB0_1
NetCPU1_GPIO_/_ADC_/_SPI_/_TWI_/_UART_2: CPU1_GPIO_/_ADC_/_SPI_/_TWI_/_UART.2 ; port CPU1_PINS.PA0_1
NetCPU1_GPIO_/_ADC_/_SPI_/_TWI_/_UART_3: CPU1_GPIO_/_ADC_/_SPI_/_TWI_/_UART.3 ; port CPU1_PINS.PB1_1
NetCPU1_GPIO_/_ADC_/_SPI_/_TWI_/_UART_4: CPU1_GPIO_/_ADC_/_SPI_/_TWI_/_UART.4 ; port CPU1_PINS.PA1_1
NetCPU1_GPIO_/_ADC_/_SPI_/_TWI_/_UART_5: CPU1_GPIO_/_ADC_/_SPI_/_TWI_/_UART.5 ; port CPU1_PINS.PB2_1
NetCPU1_GPIO_/_ADC_/_SPI_/_TWI_/_UART_6: CPU1_GPIO_/_ADC_/_SPI_/_TWI_/_UART.6 ; port CPU1_PINS.PA2_1
NetCPU1_GPIO_/_ADC_/_SPI_/_TWI_/_UART_7: CPU1_GPIO_/_ADC_/_SPI_/_TWI_/_UART.7 ; port CPU1_PINS.PB3_1
NetCPU1_GPIO_/_ADC_/_SPI_/_TWI_/_UART_8: CPU1_GPIO_/_ADC_/_SPI_/_TWI_/_UART.8 ; port CPU1_PINS.PA3_1
NetCPU1_GPIO_/_ADC_/_SPI_/_TWI_/_UART_10: CPU1_GPIO_/_ADC_/_SPI_/_TWI_/_UART.10 ; port CPU1_PINS.PA4_1
NetCPU1_GPIO_/_ADC_/_SPI_/_TWI_/_UART_12: CPU1_GPIO_/_ADC_/_SPI_/_TWI_/_UART.12 ; port CPU1_PINS.PA5_1
NetCPU1_GPIO_/_ADC_/_SPI_/_TWI_/_UART_14: CPU1_GPIO_/_ADC_/_SPI_/_TWI_/_UART.14 ; port CPU1_PINS.PA6_1
NetCPU1_GPIO_/_ADC_/_SPI_/_TWI_/_UART_16: CPU1_GPIO_/_ADC_/_SPI_/_TWI_/_UART.16 ; port CPU1_PINS.PA7_1
NetCPU1_GPIO_/_ADC_/_SPI_/_TWI_/_UART_17: CPU1_GPIO_/_ADC_/_SPI_/_TWI_/_UART.17 ; port CPU1_PINS.PD0_1
NetCPU1_GPIO_/_ADC_/_SPI_/_TWI_/_UART_18: CPU1_GPIO_/_ADC_/_SPI_/_TWI_/_UART.18 ; port CPU1_PINS.PC7_1
NetCPU1_GPIO_/_ADC_/_SPI_/_TWI_/_UART_19: CPU1_GPIO_/_ADC_/_SPI_/_TWI_/_UART.19 ; port CPU1_PINS.PD1_1
NetCPU1_GPIO_/_ADC_/_SPI_/_TWI_/_UART_20: CPU1_GPIO_/_ADC_/_SPI_/_TWI_/_UART.20 ; port CPU1_PINS.PC6_1
NetCPU1_GPIO_/_ADC_/_SPI_/_TWI_/_UART_21: CPU1_GPIO_/_ADC_/_SPI_/_TWI_/_UART.21 ; port CPU1_PINS.PD2_1
NetCPU1_GPIO_/_ADC_/_SPI_/_TWI_/_UART_22: CPU1_GPIO_/_ADC_/_SPI_/_TWI_/_UART.22 ; port CPU1_PINS.PC5_1
NetCPU1_GPIO_/_ADC_/_SPI_/_TWI_/_UART_23: CPU1_GPIO_/_ADC_/_SPI_/_TWI_/_UART.23 ; port CPU1_PINS.PD3_1
NetCPU1_GPIO_/_ADC_/_SPI_/_TWI_/_UART_24: CPU1_GPIO_/_ADC_/_SPI_/_TWI_/_UART.24 ; port CPU1_PINS.PC4_1
NetCPU1_GPIO_/_ADC_/_SPI_/_TWI_/_UART_25: CPU1_GPIO_/_ADC_/_SPI_/_TWI_/_UART.25 ; port CPU1_PINS.PD4_1
NetCPU1_GPIO_/_ADC_/_SPI_/_TWI_/_UART_26: CPU1_GPIO_/_ADC_/_SPI_/_TWI_/_UART.26 ; port CPU1_PINS.PC3_1
NetCPU1_GPIO_/_ADC_/_SPI_/_TWI_/_UART_27: CPU1_GPIO_/_ADC_/_SPI_/_TWI_/_UART.27 ; port CPU1_PINS.PD5_1
NetCPU1_GPIO_/_ADC_/_SPI_/_TWI_/_UART_29: CPU1_GPIO_/_ADC_/_SPI_/_TWI_/_UART.29 ; port CPU1_PINS.PD8_1
NetCPU1_GPIO_/_ADC_/_SPI_/_TWI_/_UART_30: CPU1_GPIO_/_ADC_/_SPI_/_TWI_/_UART.30 ; port CPU1_PINS.PC1_1
NetCPU1_GPIO_/_ADC_/_SPI_/_TWI_/_UART_31: CPU1_GPIO_/_ADC_/_SPI_/_TWI_/_UART.31 ; port CPU1_PINS.PD7_1
NetCPU1_GPIO_/_ADC_/_SPI_/_TWI_/_UART_32: CPU1_GPIO_/_ADC_/_SPI_/_TWI_/_UART.32 ; port CPU1_PINS.PC0_1

### Library data of the parts
CPU0_EXP_PWR CPU1_EXP_PWR = Header 4X2: Header, 4-Pin, Dual row; LatestRevisionDate: 17-Jul-2002; LatestRevisionNote: Re-released for DXP Platform.; Publisher: Altium Limited
CPU0_GPIO_/_ADC_/_SPI_/_TWI_/_UART CPU1_GPIO_/_ADC_/_SPI_/_TWI_/_UART = Header 16X2: Header, 16-Pin, Dual row; LatestRevisionDate: 17-Jul-2002; LatestRevisionNote: Re-released for DXP Platform.; Publisher: Altium Limited

## Sheet AVR Board 4.0 Power Supply.SchDoc
size A
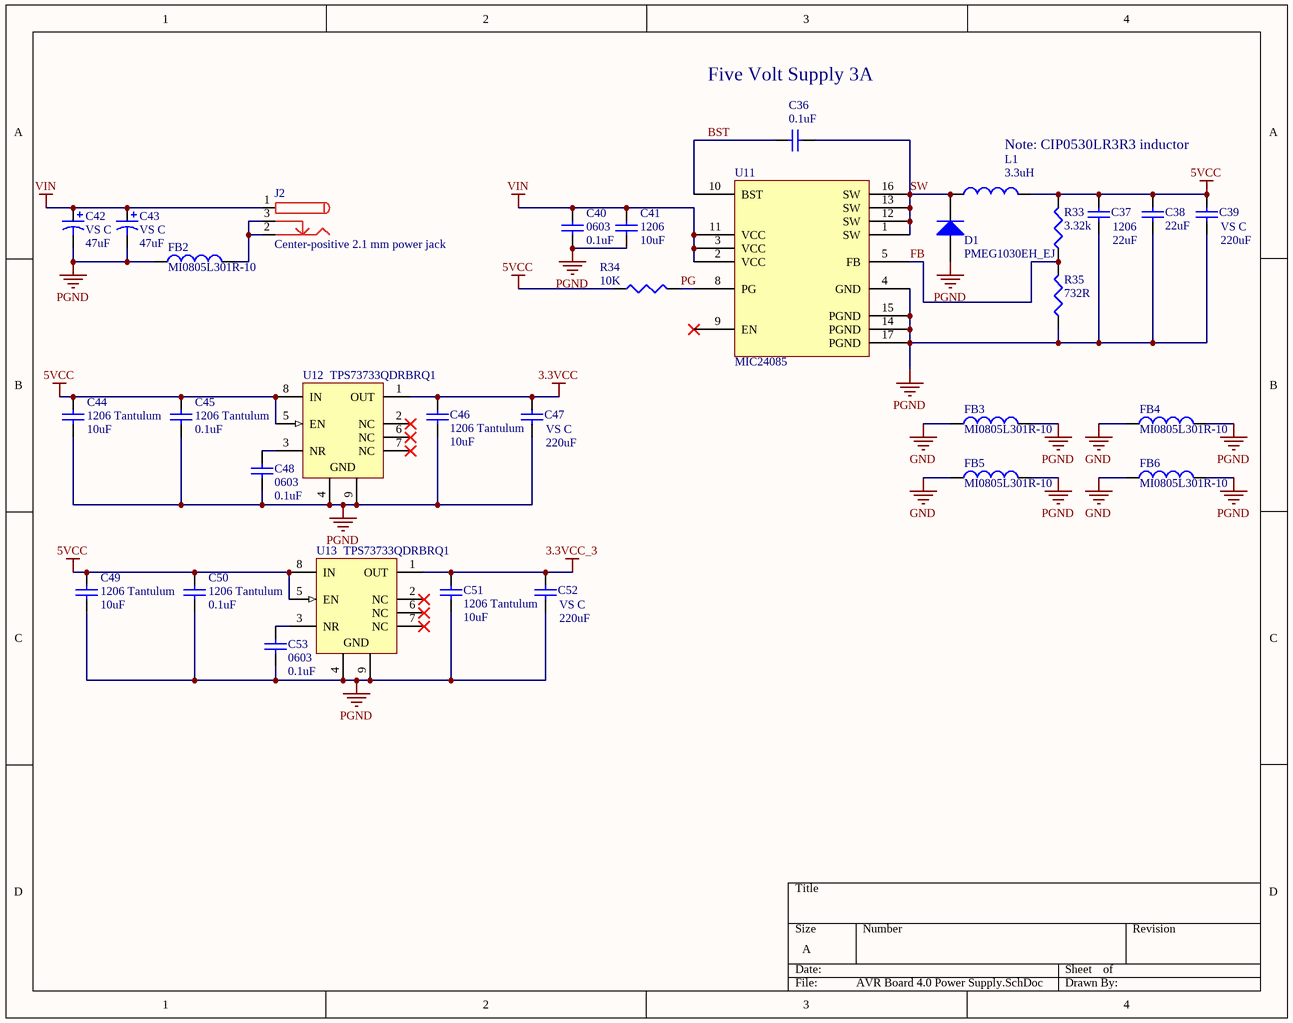
[diagram p4: AVR Board 4.0 Power Supply.SchDoc]

### Parts
C36  value 0.1uF  [1608[0603]]  (hidden comment: Cap Semi)
C37  1206  value 22uF  [C1206]
C38  value 22uF  [C1206]  (hidden comment: Cap Semi)
C39  VS C  value 220uF  [Panasonic VS C]
C40  0603  value 0.1uF  [1608[0603]]
C41  1206  value 10uF  [C1206]
C42  VS C  value 47uF  [Panasonic VS C]
C43  VS C  value 47uF  [Panasonic VS C]
C44  1206 Tantulum  value 10uF  [C1206]
C45  1206 Tantulum  value 0.1uF  [C1206]
C46  1206 Tantulum  value 10uF  [C1206]
C47  VS C  value 220uF  [Panasonic VS C]
C48  0603  value 0.1uF  [1608[0603]]
C49  1206 Tantulum  value 10uF  [C1206]
C50  1206 Tantulum  value 0.1uF  [C1206]
C51  1206 Tantulum  value 10uF  [C1206]
C52  VS C  value 220uF  [Panasonic VS C]
C53  0603  value 0.1uF  [1608[0603]]
D1  PMEG1030EH_EJ  [PMEG1030EH_EJ]
FB2  MI0805L301R-10  [SM 0805 - gap trimmed]
FB3  MI0805L301R-10  [SM 0805 - gap trimmed]
FB4  MI0805L301R-10  [SM 0805 - gap trimmed]
FB5  MI0805L301R-10  [SM 0805 - gap trimmed]
FB6  MI0805L301R-10  [SM 0805 - gap trimmed]
J2  Center-positive 2.1 mm power jack  [PJ-102AH]
L1  value 3.3uH  [CIP0530LR3R3]  (hidden comment: Inductor)
R33  value 3.32k  [J1-0603]  (hidden comment: Res3)
R34  value 10K  [J1-0603]  (hidden comment: Res3)
R35  value 732R  [J1-0603]  (hidden comment: Res3)
U11  MIC24085  [MIC24085-AYML]
U12  TPS73733QDRBRQ1  [TI-DRB8-1750X1500TP_V]
U13  TPS73733QDRBRQ1  [TI-DRB8-1750X1500TP_V]

### Nets
3.3VCC: C46.1 C47.1 U12.1(OUT)
3.3VCC_3: C51.1 C52.1 U13.1(OUT)
5VCC: C37.2 C38.1 C39.1 C44.1 C45.2 C49.1 C50.2 L1.2 R33.2 R34.1 U12.5(EN) U12.8(IN) U13.5(EN) U13.8(IN)
GND: FB3.1 FB4.1 FB5.1 FB6.1
PGND: C37.1 C38.2 C39.2 C40.1 C41.1 C42.2 C43.2 C44.2 C45.1 C46.2 C47.2 C48.1 C49.2 C50.1 C51.2 C52.2 C53.1 D1.1(A) FB2.1 FB3.2 FB4.2 FB5.2 FB6.2 R35.1 U11.4(GND) U11.14(PGND) U11.15(PGND) U11.17(PGND) U12.4(GND) U12.9(GND) U13.4(GND) U13.9(GND)
VIN: C40.2 C41.2 C42.1 C43.1 J2.1 U11.2(VCC) U11.3(VCC) U11.11(VCC)
BST: C36.2 U11.10(BST)
FB: R33.1 R35.2 U11.5(FB)
PG: R34.2 U11.8(PG)
SW: C36.1 D1.2(K) L1.1 U11.1(SW) U11.12(SW) U11.13(SW) U11.16(SW)
NetC48_2: C48.2 U12.3(NR)
NetC53_2: C53.2 U13.3(NR)
NetFB2_2: FB2.2 J2.2 J2.3

Not connected (* = marked no-connect by the designer): U11 6(NC) 7(NC) 9(EN)*; U12 2(NC)* 6(NC)* 7(NC)*; U13 2(NC)* 6(NC)* 7(NC)*

### Notes on the sheet
- Five Volt Supply 3A
- Note: CIP0530LR3R3 inductor

### Library data of the parts
C36-C41 C44-C53 = Cap Semi: Capacitor (Semiconductor SIM Model); Published: 8-Jun-2000; LatestRevisionDate: 29-May-2009; LatestRevisionNote: IPC-7351 Footprint Added.; PackageReference: C1206; Publisher: Altium Limited; PackageDescription: Chip Capacitor
C42 C43 = Cap Pol3: Polarized Capacitor (Surface Mount); Published: 8-Jun-2000; LatestRevisionDate: 29-May-2009; LatestRevisionNote: IPC-7351 Footprint Added.; PackageReference: C0805; Publisher: Altium Limited; PackageDescription: Chip Capacitor
D1 = Diode: Default Diode; Published: 8-Jun-2000; LatestRevisionDate: 17-Jul-2002; LatestRevisionNote: Re-released for DXP Platform.; PackageVersion: Sep-1996; PackageReference: SMC; Publisher: Altium Limited; PackageDescription: DO-214-AB/SMC; 2 C-Bend Leads; Body 7.9 x 5.9 mm, inc. leads (LxW); Code_JEDEC: DO-214-AB
FB2-FB6 L1 = Inductor: Code_IEC: 1005; Published: 8-Jun-2000; PackageReference: 0402-A; Publisher: Altium Limited; Code_JEITA: 0402
  FB2-FB6: LatestRevisionDate: 17-Jul-2002; LatestRevisionNote: Re-released for DXP Platform.
  L1: LatestRevisionDate: 29-May-2009; LatestRevisionNote: IPC-7351 Footprint Added.; PackageDescription: Chip Inductor
J2 = PWR2.5: Power jack; Published: 17-Dec-2003; DatasheetDocument: 09-May-2002; Publisher: Altium Limited; ComponentLink1Description: Manufacturer Link; ComponentLink1URL: http://domino.kycon.com/internet/Products.html
R33-R35 = Res3: Resistor; Published: 8-Jun-2000; LatestRevisionDate: 29-May-2009; LatestRevisionNote: IPC-7351 Footprint Added.; PackageReference: J1-0603; Publisher: Altium Limited; PackageDescription: Chip Resistor
U12 U13 = TPS73733QDRBRQ1: Single Output Automotive LDO, 1 A, Fixed 3.3 V Output, 2.2 to 5.5 V Input, with Reverse Current Protection, 8-pin SON (DRB), -40 to 125 degC, Green (RoHS & no Sb/Br); Manufacturer: Texas Instruments; Accuracy(%): 3; Fixed Output Options(V): 3.3; Iout(Max)(A): 1; Iq(Typ)(mA): 0.3; SubFamily: Single Channel LDO; Vdo(Typ)(mV): 130; Vin(Max)(V): 5.5; Vin(Min)(V): 2.2; DatasheetVersion: SBVS123; PackageVersion: 4203482-2/K; PackageReference: DRB8-1750X1500TP; PackageDescription: 8-Pin Plastic Small Outline, Body 3 x 3 mm, Pitch 0.65 mm; Supplier 1: Digi-Key; Supplier Part Number 1: 296-24157-2-ND; Supplier 2: Digi-Key; Supplier Part Number 2: 296-24157-1-ND; Supplier 3: Digi-Key; Supplier Part Number 3: 296-24157-6-ND; Supplier 4: Newark; Supplier Part Number 4: 56P3118; Supplier 5: Mouser; Supplier Part Number 5: 595-TPS73733QDRBRQ1; Eco-Plan: Green (RoHS & no Sb/Br); Rating: Automotive; Vout Adj(Max)(V): 3.3; Vout Adj(Min)(V): 3.3; Mounting Technology: Surface Mount; PartNumber: TPS73733QDRBRQ1; ComponentLink1Description: Manufacturer URL; ComponentLink1URL: http://www.ti.com/; ComponentLink2Description: Datasheet; ComponentLink2URL: http://www.ti.com/general/docs/lit/getliterature.tsp?genericPartNumber=TPS73733-Q1&fileType=pdf; ComponentLink3Description: Package Specification; ComponentLink3URL: http://www.ti.com/litv/pdf/mpds118h

## Nets that join several sheets
3.3VCC: AVR Board 4.0 Processors  (14 pins), AVR Board 4.0 FTDI USB (6 pins), AVR Board 4.0 Power Supply (C46.1 C47.1 U12.1)
3.3VCC_3: AVR Board 4.0 Ports (CPU0_EXP_PWR.1 CPU0_EXP_PWR.2 CPU1_EXP_PWR.1 CPU1_EXP_PWR.2), AVR Board 4.0 Power Supply (C51.1 C52.1 U13.1)
5VCC: AVR Board 4.0 Processors  (13 pins), AVR Board 4.0 FTDI USB (C3.2 C4.2 U1.14), AVR Board 4.0 Ports (CPU0_EXP_PWR.5 CPU0_EXP_PWR.6 CPU1_EXP_PWR.5 CPU1_EXP_PWR.6), AVR Board 4.0 Power Supply (14 pins)
GND: AVR Board 4.0 Processors  (29 pins), AVR Board 4.0 FTDI USB (44 pins), AVR Board 4.0 Ports (8 pins), AVR Board 4.0 Power Supply (FB3.1 FB4.1 FB5.1 FB6.1)
CC_SS0: AVR Board 4.0 Processors  (CPU0-Slave.2 U14.5), AVR Board 4.0 Ports (CPU0_GPIO_/_ADC_/_SPI_/_TWI_/_UART.9)
MISO_0: AVR Board 4.0 Processors  (CPU0_ISP.1 CPU0_SPI_Bridge_Select.3 U14.7), AVR Board 4.0 Ports (CPU0_GPIO_/_ADC_/_SPI_/_TWI_/_UART.13)
MISO_1: AVR Board 4.0 Processors  (CPU1_ISP.1 CPU1_SPI_Bridge_Select.4 U15.7), AVR Board 4.0 Ports (CPU1_GPIO_/_ADC_/_SPI_/_TWI_/_UART.13)
MOSI_0: AVR Board 4.0 Processors  (CPU0_ISP.4 CPU0_SPI_Bridge_Select.1 U14.6), AVR Board 4.0 Ports (CPU0_GPIO_/_ADC_/_SPI_/_TWI_/_UART.11)
MOSI_1: AVR Board 4.0 Processors  (CPU1_ISP.4 CPU1_SPI_Bridge_Select.2 U15.6), AVR Board 4.0 Ports (CPU1_GPIO_/_ADC_/_SPI_/_TWI_/_UART.11)
NetCPU0-Master_1: AVR Board 4.0 Processors  (CPU0-Master.1 U14.24), AVR Board 4.0 Ports (CPU0_GPIO_/_ADC_/_SPI_/_TWI_/_UART.28)
NetCPU0_GPIO_/_ADC_/_SPI_/_TWI_/_UART_1: AVR Board 4.0 Processors  (U14.1), AVR Board 4.0 Ports (CPU0_GPIO_/_ADC_/_SPI_/_TWI_/_UART.1)
NetCPU0_GPIO_/_ADC_/_SPI_/_TWI_/_UART_2: AVR Board 4.0 Processors  (U14.40), AVR Board 4.0 Ports (CPU0_GPIO_/_ADC_/_SPI_/_TWI_/_UART.2)
NetCPU0_GPIO_/_ADC_/_SPI_/_TWI_/_UART_3: AVR Board 4.0 Processors  (U14.2), AVR Board 4.0 Ports (CPU0_GPIO_/_ADC_/_SPI_/_TWI_/_UART.3)
NetCPU0_GPIO_/_ADC_/_SPI_/_TWI_/_UART_4: AVR Board 4.0 Processors  (U14.39), AVR Board 4.0 Ports (CPU0_GPIO_/_ADC_/_SPI_/_TWI_/_UART.4)
NetCPU0_GPIO_/_ADC_/_SPI_/_TWI_/_UART_5: AVR Board 4.0 Processors  (U14.3), AVR Board 4.0 Ports (CPU0_GPIO_/_ADC_/_SPI_/_TWI_/_UART.5)
NetCPU0_GPIO_/_ADC_/_SPI_/_TWI_/_UART_6: AVR Board 4.0 Processors  (U14.38), AVR Board 4.0 Ports (CPU0_GPIO_/_ADC_/_SPI_/_TWI_/_UART.6)
NetCPU0_GPIO_/_ADC_/_SPI_/_TWI_/_UART_7: AVR Board 4.0 Processors  (U14.4), AVR Board 4.0 Ports (CPU0_GPIO_/_ADC_/_SPI_/_TWI_/_UART.7)
NetCPU0_GPIO_/_ADC_/_SPI_/_TWI_/_UART_8: AVR Board 4.0 Processors  (U14.37), AVR Board 4.0 Ports (CPU0_GPIO_/_ADC_/_SPI_/_TWI_/_UART.8)
NetCPU0_GPIO_/_ADC_/_SPI_/_TWI_/_UART_10: AVR Board 4.0 Processors  (U14.36), AVR Board 4.0 Ports (CPU0_GPIO_/_ADC_/_SPI_/_TWI_/_UART.10)
NetCPU0_GPIO_/_ADC_/_SPI_/_TWI_/_UART_12: AVR Board 4.0 Processors  (U14.35), AVR Board 4.0 Ports (CPU0_GPIO_/_ADC_/_SPI_/_TWI_/_UART.12)
NetCPU0_GPIO_/_ADC_/_SPI_/_TWI_/_UART_14: AVR Board 4.0 Processors  (U14.34), AVR Board 4.0 Ports (CPU0_GPIO_/_ADC_/_SPI_/_TWI_/_UART.14)
NetCPU0_GPIO_/_ADC_/_SPI_/_TWI_/_UART_16: AVR Board 4.0 Processors  (U14.33), AVR Board 4.0 Ports (CPU0_GPIO_/_ADC_/_SPI_/_TWI_/_UART.16)
NetCPU0_GPIO_/_ADC_/_SPI_/_TWI_/_UART_17: AVR Board 4.0 Processors  (FTDI_Serial.10 U14.14), AVR Board 4.0 Ports (CPU0_GPIO_/_ADC_/_SPI_/_TWI_/_UART.17)
NetCPU0_GPIO_/_ADC_/_SPI_/_TWI_/_UART_18: AVR Board 4.0 Processors  (U14.29), AVR Board 4.0 Ports (CPU0_GPIO_/_ADC_/_SPI_/_TWI_/_UART.18)
NetCPU0_GPIO_/_ADC_/_SPI_/_TWI_/_UART_19: AVR Board 4.0 Processors  (FTDI_Serial.12 U14.15), AVR Board 4.0 Ports (CPU0_GPIO_/_ADC_/_SPI_/_TWI_/_UART.19)
NetCPU0_GPIO_/_ADC_/_SPI_/_TWI_/_UART_20: AVR Board 4.0 Processors  (U14.28), AVR Board 4.0 Ports (CPU0_GPIO_/_ADC_/_SPI_/_TWI_/_UART.20)
NetCPU0_GPIO_/_ADC_/_SPI_/_TWI_/_UART_21: AVR Board 4.0 Processors  (FTDI_Serial.14 U14.16), AVR Board 4.0 Ports (CPU0_GPIO_/_ADC_/_SPI_/_TWI_/_UART.21)
NetCPU0_GPIO_/_ADC_/_SPI_/_TWI_/_UART_22: AVR Board 4.0 Processors  (U14.27), AVR Board 4.0 Ports (CPU0_GPIO_/_ADC_/_SPI_/_TWI_/_UART.22)
NetCPU0_GPIO_/_ADC_/_SPI_/_TWI_/_UART_23: AVR Board 4.0 Processors  (FTDI_Serial.16 U14.17), AVR Board 4.0 Ports (CPU0_GPIO_/_ADC_/_SPI_/_TWI_/_UART.23)
NetCPU0_GPIO_/_ADC_/_SPI_/_TWI_/_UART_24: AVR Board 4.0 Processors  (U14.26), AVR Board 4.0 Ports (CPU0_GPIO_/_ADC_/_SPI_/_TWI_/_UART.24)
NetCPU0_GPIO_/_ADC_/_SPI_/_TWI_/_UART_25: AVR Board 4.0 Processors  (U14.18), AVR Board 4.0 Ports (CPU0_GPIO_/_ADC_/_SPI_/_TWI_/_UART.25)
NetCPU0_GPIO_/_ADC_/_SPI_/_TWI_/_UART_26: AVR Board 4.0 Processors  (U14.25), AVR Board 4.0 Ports (CPU0_GPIO_/_ADC_/_SPI_/_TWI_/_UART.26)
NetCPU0_GPIO_/_ADC_/_SPI_/_TWI_/_UART_27: AVR Board 4.0 Processors  (U14.19), AVR Board 4.0 Ports (CPU0_GPIO_/_ADC_/_SPI_/_TWI_/_UART.27)
NetCPU0_GPIO_/_ADC_/_SPI_/_TWI_/_UART_29: AVR Board 4.0 Processors  (U14.20), AVR Board 4.0 Ports (CPU0_GPIO_/_ADC_/_SPI_/_TWI_/_UART.29)
NetCPU0_GPIO_/_ADC_/_SPI_/_TWI_/_UART_30: AVR Board 4.0 Processors  (U14.23), AVR Board 4.0 Ports (CPU0_GPIO_/_ADC_/_SPI_/_TWI_/_UART.30)
NetCPU0_GPIO_/_ADC_/_SPI_/_TWI_/_UART_31: AVR Board 4.0 Processors  (U14.21), AVR Board 4.0 Ports (CPU0_GPIO_/_ADC_/_SPI_/_TWI_/_UART.31)
NetCPU0_GPIO_/_ADC_/_SPI_/_TWI_/_UART_32: AVR Board 4.0 Processors  (U14.22), AVR Board 4.0 Ports (CPU0_GPIO_/_ADC_/_SPI_/_TWI_/_UART.32)
NetCPU1-Master_2: AVR Board 4.0 Processors  (CPU1-Master.2 U15.24), AVR Board 4.0 Ports (CPU1_GPIO_/_ADC_/_SPI_/_TWI_/_UART.28)
NetCPU1-Slave_1: AVR Board 4.0 Processors  (CPU1-Slave.1 U15.5), AVR Board 4.0 Ports (CPU1_GPIO_/_ADC_/_SPI_/_TWI_/_UART.9)
NetCPU1_GPIO_/_ADC_/_SPI_/_TWI_/_UART_1: AVR Board 4.0 Processors  (U15.1), AVR Board 4.0 Ports (CPU1_GPIO_/_ADC_/_SPI_/_TWI_/_UART.1)
NetCPU1_GPIO_/_ADC_/_SPI_/_TWI_/_UART_2: AVR Board 4.0 Processors  (U15.40), AVR Board 4.0 Ports (CPU1_GPIO_/_ADC_/_SPI_/_TWI_/_UART.2)
NetCPU1_GPIO_/_ADC_/_SPI_/_TWI_/_UART_3: AVR Board 4.0 Processors  (U15.2), AVR Board 4.0 Ports (CPU1_GPIO_/_ADC_/_SPI_/_TWI_/_UART.3)
NetCPU1_GPIO_/_ADC_/_SPI_/_TWI_/_UART_4: AVR Board 4.0 Processors  (U15.39), AVR Board 4.0 Ports (CPU1_GPIO_/_ADC_/_SPI_/_TWI_/_UART.4)
NetCPU1_GPIO_/_ADC_/_SPI_/_TWI_/_UART_5: AVR Board 4.0 Processors  (U15.3), AVR Board 4.0 Ports (CPU1_GPIO_/_ADC_/_SPI_/_TWI_/_UART.5)
NetCPU1_GPIO_/_ADC_/_SPI_/_TWI_/_UART_6: AVR Board 4.0 Processors  (U15.38), AVR Board 4.0 Ports (CPU1_GPIO_/_ADC_/_SPI_/_TWI_/_UART.6)
NetCPU1_GPIO_/_ADC_/_SPI_/_TWI_/_UART_7: AVR Board 4.0 Processors  (U15.4), AVR Board 4.0 Ports (CPU1_GPIO_/_ADC_/_SPI_/_TWI_/_UART.7)
NetCPU1_GPIO_/_ADC_/_SPI_/_TWI_/_UART_8: AVR Board 4.0 Processors  (U15.37), AVR Board 4.0 Ports (CPU1_GPIO_/_ADC_/_SPI_/_TWI_/_UART.8)
NetCPU1_GPIO_/_ADC_/_SPI_/_TWI_/_UART_10: AVR Board 4.0 Processors  (U15.36), AVR Board 4.0 Ports (CPU1_GPIO_/_ADC_/_SPI_/_TWI_/_UART.10)
NetCPU1_GPIO_/_ADC_/_SPI_/_TWI_/_UART_12: AVR Board 4.0 Processors  (U15.35), AVR Board 4.0 Ports (CPU1_GPIO_/_ADC_/_SPI_/_TWI_/_UART.12)
NetCPU1_GPIO_/_ADC_/_SPI_/_TWI_/_UART_14: AVR Board 4.0 Processors  (U15.34), AVR Board 4.0 Ports (CPU1_GPIO_/_ADC_/_SPI_/_TWI_/_UART.14)
NetCPU1_GPIO_/_ADC_/_SPI_/_TWI_/_UART_16: AVR Board 4.0 Processors  (U15.33), AVR Board 4.0 Ports (CPU1_GPIO_/_ADC_/_SPI_/_TWI_/_UART.16)
NetCPU1_GPIO_/_ADC_/_SPI_/_TWI_/_UART_17: AVR Board 4.0 Processors  (FTDI_Serial.2 U15.14), AVR Board 4.0 Ports (CPU1_GPIO_/_ADC_/_SPI_/_TWI_/_UART.17)
NetCPU1_GPIO_/_ADC_/_SPI_/_TWI_/_UART_18: AVR Board 4.0 Processors  (U15.29), AVR Board 4.0 Ports (CPU1_GPIO_/_ADC_/_SPI_/_TWI_/_UART.18)
NetCPU1_GPIO_/_ADC_/_SPI_/_TWI_/_UART_19: AVR Board 4.0 Processors  (FTDI_Serial.4 U15.15), AVR Board 4.0 Ports (CPU1_GPIO_/_ADC_/_SPI_/_TWI_/_UART.19)
NetCPU1_GPIO_/_ADC_/_SPI_/_TWI_/_UART_20: AVR Board 4.0 Processors  (U15.28), AVR Board 4.0 Ports (CPU1_GPIO_/_ADC_/_SPI_/_TWI_/_UART.20)
NetCPU1_GPIO_/_ADC_/_SPI_/_TWI_/_UART_21: AVR Board 4.0 Processors  (FTDI_Serial.6 U15.16), AVR Board 4.0 Ports (CPU1_GPIO_/_ADC_/_SPI_/_TWI_/_UART.21)
NetCPU1_GPIO_/_ADC_/_SPI_/_TWI_/_UART_22: AVR Board 4.0 Processors  (U15.27), AVR Board 4.0 Ports (CPU1_GPIO_/_ADC_/_SPI_/_TWI_/_UART.22)
NetCPU1_GPIO_/_ADC_/_SPI_/_TWI_/_UART_23: AVR Board 4.0 Processors  (FTDI_Serial.8 U15.17), AVR Board 4.0 Ports (CPU1_GPIO_/_ADC_/_SPI_/_TWI_/_UART.23)
NetCPU1_GPIO_/_ADC_/_SPI_/_TWI_/_UART_24: AVR Board 4.0 Processors  (U15.26), AVR Board 4.0 Ports (CPU1_GPIO_/_ADC_/_SPI_/_TWI_/_UART.24)
NetCPU1_GPIO_/_ADC_/_SPI_/_TWI_/_UART_25: AVR Board 4.0 Processors  (U15.18), AVR Board 4.0 Ports (CPU1_GPIO_/_ADC_/_SPI_/_TWI_/_UART.25)
NetCPU1_GPIO_/_ADC_/_SPI_/_TWI_/_UART_26: AVR Board 4.0 Processors  (U15.25), AVR Board 4.0 Ports (CPU1_GPIO_/_ADC_/_SPI_/_TWI_/_UART.26)
NetCPU1_GPIO_/_ADC_/_SPI_/_TWI_/_UART_27: AVR Board 4.0 Processors  (U15.19), AVR Board 4.0 Ports (CPU1_GPIO_/_ADC_/_SPI_/_TWI_/_UART.27)
NetCPU1_GPIO_/_ADC_/_SPI_/_TWI_/_UART_29: AVR Board 4.0 Processors  (U15.20), AVR Board 4.0 Ports (CPU1_GPIO_/_ADC_/_SPI_/_TWI_/_UART.29)
NetCPU1_GPIO_/_ADC_/_SPI_/_TWI_/_UART_30: AVR Board 4.0 Processors  (U15.23), AVR Board 4.0 Ports (CPU1_GPIO_/_ADC_/_SPI_/_TWI_/_UART.30)
NetCPU1_GPIO_/_ADC_/_SPI_/_TWI_/_UART_31: AVR Board 4.0 Processors  (U15.21), AVR Board 4.0 Ports (CPU1_GPIO_/_ADC_/_SPI_/_TWI_/_UART.31)
NetCPU1_GPIO_/_ADC_/_SPI_/_TWI_/_UART_32: AVR Board 4.0 Processors  (U15.22), AVR Board 4.0 Ports (CPU1_GPIO_/_ADC_/_SPI_/_TWI_/_UART.32)
NetFTDI_Serial_1: AVR Board 4.0 Processors  (FTDI_Serial.1), AVR Board 4.0 FTDI USB (R4.2)
NetFTDI_Serial_3: AVR Board 4.0 Processors  (FTDI_Serial.3), AVR Board 4.0 FTDI USB (R3.2)
NetFTDI_Serial_5: AVR Board 4.0 Processors  (FTDI_Serial.5), AVR Board 4.0 FTDI USB (R2.2)
NetFTDI_Serial_7: AVR Board 4.0 Processors  (FTDI_Serial.7), AVR Board 4.0 FTDI USB (R1.2)
NetFTDI_Serial_9: AVR Board 4.0 Processors  (FTDI_Serial.9), AVR Board 4.0 FTDI USB (R7.2)
NetFTDI_Serial_11: AVR Board 4.0 Processors  (FTDI_Serial.11), AVR Board 4.0 FTDI USB (R8.2)
NetFTDI_Serial_13: AVR Board 4.0 Processors  (FTDI_Serial.13), AVR Board 4.0 FTDI USB (R6.2)
NetFTDI_Serial_15: AVR Board 4.0 Processors  (FTDI_Serial.15), AVR Board 4.0 FTDI USB (R5.2)
SCK_0: AVR Board 4.0 Processors  (CPU0_ISP.3 CPU0_SPI_Bridge_Select.5 U14.8), AVR Board 4.0 Ports (CPU0_GPIO_/_ADC_/_SPI_/_TWI_/_UART.15)
SCK_1: AVR Board 4.0 Processors  (CPU1_ISP.3 CPU1_SPI_Bridge_Select.6 U15.8), AVR Board 4.0 Ports (CPU1_GPIO_/_ADC_/_SPI_/_TWI_/_UART.15)